# Altium project ee_453_yourname.PrjPcb (part 1 of 2)
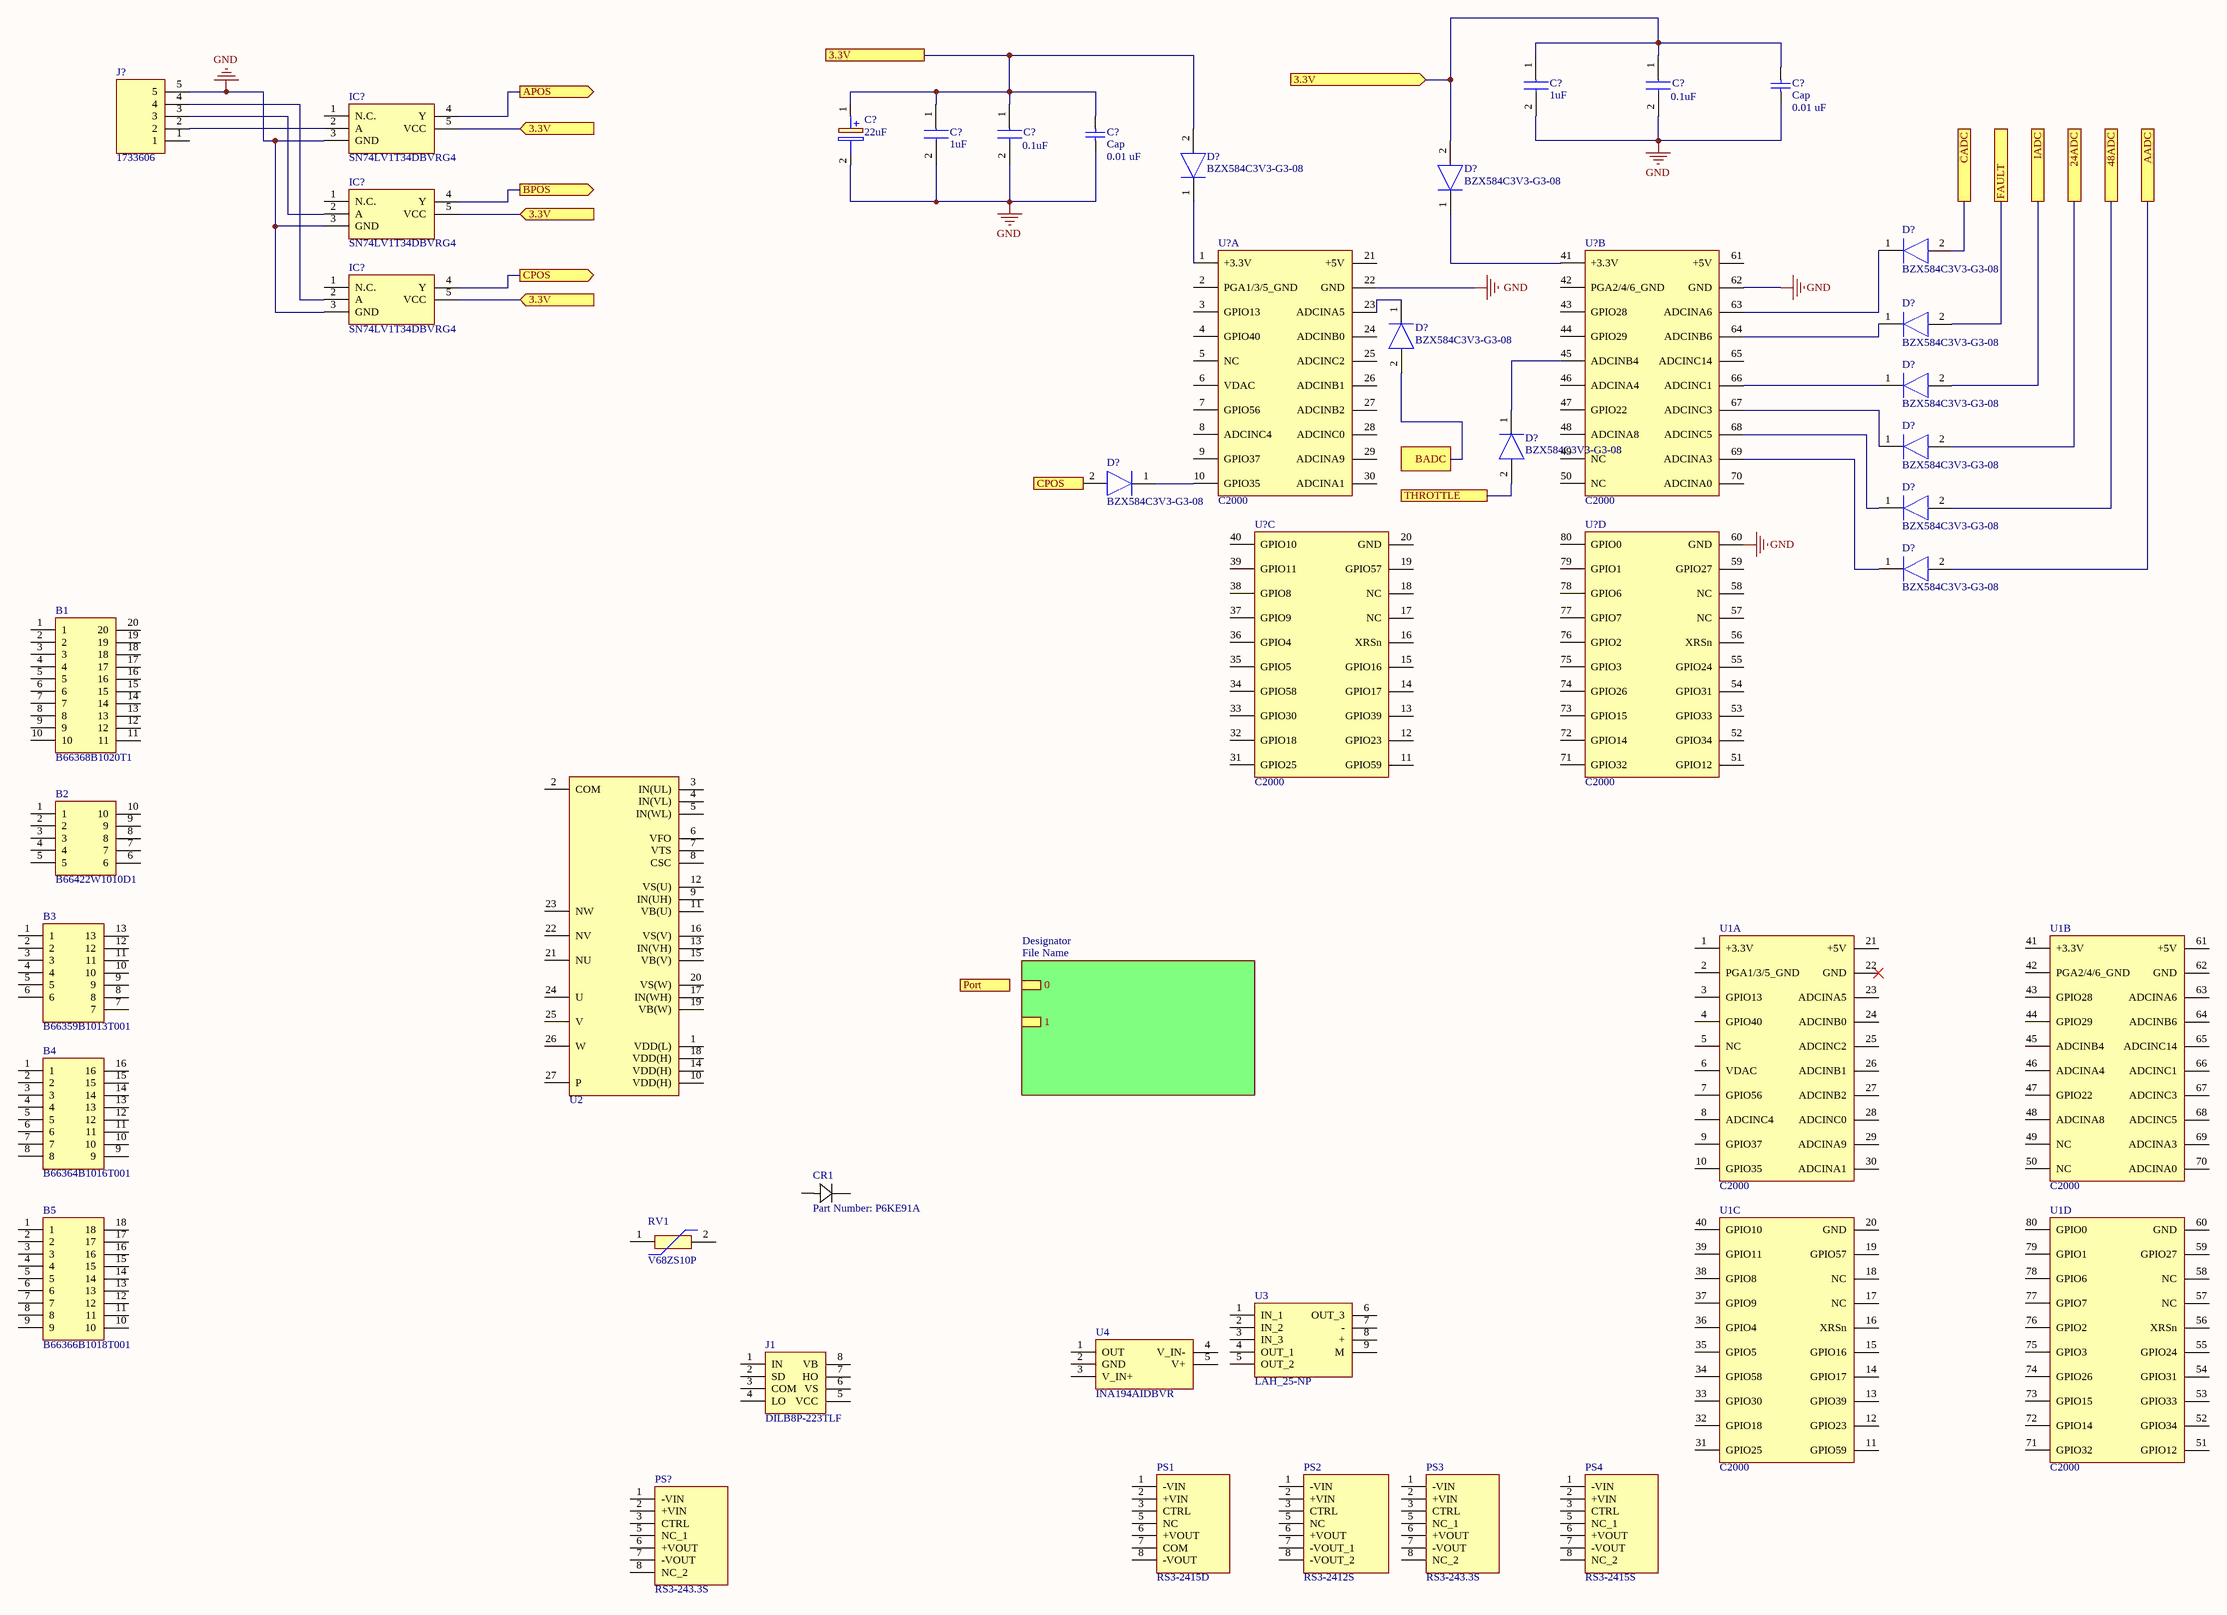
[diagram p0: ee453_pcb_yourname.SchDoc]
7 sheets, 137 parts. Net scope: hierarchical (ports join the sheet entries above them; power ports are global).
Board file: ee453_pcb_yourname.PcbDoc
Sheets:
  ee453_pcb_yourname.SchDoc
  Overall.SchDoc
    DSP = TI_DSP_OLD.SchDoc
    PowerSupply = PowerSupply.SchDoc
    BoostStage = BoostStage.SchDoc
    DrivePowerModule = DrivePowerModule.SchDoc
    Sensors = Sensors.SchDoc

## Sheet ee453_pcb_yourname.SchDoc: EE 453 Capstone
size C; ApprovedBy: Your Name; CheckedBy: Your Name; Author: Your Name; CompanyName: Dept. of Elec. and Comp. Engg.; DrawnBy: Your Name; Engineer: Your Nmae; Organization: UW-Seattle; Address1: 185 Stevens Way; Address2: Paul Allen Center; Address3: Seattle, WA; Address4: US-98195; DocumentNumber: 1; Revision: 1.0; SheetNumber: 1; SheetTotal: 1

### Parts
(Parts that share a designator on the sheet are numbered #1, #2 ... from top to bottom, then left to right.)
B1  B66368B1020T1  [B66368B1020T1]
B2  B66422W1010D1  [B66422W1010D1]
B3  B66359B1013T001  [B66359B1013T001]
B4  B66364B1016T001  [B66364B1016T001]
B5  B66366B1018T001  [B66366B1018T001]
C?#1  1uF  [C330C105K5R5TA7303]
C?#2  0.1uF  [K104K10X7RF5UH5]
C?#3  Cap  value 0.01 uF  [RAD-0.3]
C?#4  22uF  [CAPPRD500W65D1000H2200]
C?#5  1uF  [C330C105K5R5TA7303]
C?#6  0.1uF  [K104K10X7RF5UH5]
C?#7  Cap  value 0.01 uF  [RAD-0.3]
CR1  Part Number: P6KE91A  [P6KESeries]
D?#1  BZX584C3V3-G3-08  [SODFL1608X75N]
D?#2  BZX584C3V3-G3-08  [SODFL1608X75N]
D?#3  BZX584C3V3-G3-08  [SODFL1608X75N]
D?#4  BZX584C3V3-G3-08  [SODFL1608X75N]
D?#5  BZX584C3V3-G3-08  [SODFL1608X75N]
D?#6  BZX584C3V3-G3-08  [SODFL1608X75N]
D?#7  BZX584C3V3-G3-08  [SODFL1608X75N]
D?#8  BZX584C3V3-G3-08  [SODFL1608X75N]
D?#9  BZX584C3V3-G3-08  [SODFL1608X75N]
D?#10  BZX584C3V3-G3-08  [SODFL1608X75N]
D?#11  BZX584C3V3-G3-08  [SODFL1608X75N]
IC?#1  SN74LV1T34DBVRG4  [SOT95P280X145-5N]
IC?#2  SN74LV1T34DBVRG4  [SOT95P280X145-5N]
IC?#3  SN74LV1T34DBVRG4  [SOT95P280X145-5N]
J1  DILB8P-223TLF  [DIPS762W60P254L1016H525Q8N]
J?  1733606  [1733606]
PS1#1  RS3-2415D  [RS32405DH3]
PS2#1  RS3-2412S  [RS32415S]
PS3#1  RS3-243.3S  [RS32433S]
PS4  RS3-2415S  [RS32415S]
PS?  RS3-243.3S  [RS32433S]
RV1  V68ZS10P  [V68ZS10P]
U1  C2000  [C2000]  (parts A,B,C,D of 4)
U2  FNB34060T  [FNB34060T]  (value not drawn)
U3  LAH_25-NP  [LAH-25-NP]
U4  INA194AIDBVR  [SOT95P280X145-5N]
U?#1  C2000  [C2000]  (part B of 4)
U?#2  C2000  [C2000]  (part A of 4)
U?#3  C2000  [C2000]  (part C of 4)
U?#4  C2000  [C2000]  (part D of 4)

### Sub-sheets
Designator = File Name (file not in this document): 0, 1

### Ports
3.3V, 3.3V (in), 24ADC, 48ADC, AADC, APOS (out), BADC, BPOS (out), CADC, CPOS, CPOS (out), FAULT, IADC, Port, THROTTLE

### Nets
 GND: C?#1.2 C?#2.2 C?#3.1 C?#4.2(-) C?#5.2 C?#6.2 C?#7.1 IC?#1.3(GND) IC?#2.3(GND) IC?#3.3(GND) J?.5 U?#1.62(GND) U?#2.22(GND) U?#4.60(GND)  [also labelled GND]
NetC?#1_1: C?#1.1 C?#2.1 C?#3.2 C?#4.1(+) C?#5.1 C?#6.1 C?#7.2 D?#1.2(A) D?#2.2(A) IC?#1.5(VCC) IC?#2.5(VCC) IC?#3.5(VCC) ; port 3.3V
NetD?#1_1: D?#1.1(K) U?#2.1(+3.3V)
NetD?#2_1: D?#2.1(K) U?#1.41(+3.3V)
NetD?#3_1: D?#3.1(K) U?#1.63(ADCINA6)
NetD?#3_2: D?#3.2(A) ; port CADC
NetD?#4_1: D?#4.1(K) U?#2.23(ADCINA5)
NetD?#4_2: D?#4.2(A) ; port BADC
NetD?#5_1: D?#5.1(K) U?#1.64(ADCINB6)
NetD?#5_2: D?#5.2(A) ; port FAULT
NetD?#6_1: D?#6.1(K) U?#1.66(ADCINC1)
NetD?#6_2: D?#6.2(A) ; port IADC
NetD?#7_1: D?#7.1(K) U?#1.45(ADCINB4)
NetD?#7_2: D?#7.2(A) ; port THROTTLE
NetD?#8_1: D?#8.1(K) U?#1.67(ADCINC3)
NetD?#8_2: D?#8.2(A) ; port 24ADC
NetD?#9_1: D?#9.1(K) U?#2.10(GPIO35)
NetD?#9_2: D?#9.2(A) IC?#3.4(Y) ; port CPOS
NetD?#10_1: D?#10.1(K) U?#1.68(ADCINC5)
NetD?#10_2: D?#10.2(A) ; port 48ADC
NetD?#11_1: D?#11.1(K) U?#1.69(ADCINA3)
NetD?#11_2: D?#11.2(A) ; port AADC
NetIC?#1_2: IC?#1.2(A) J?.2
NetIC?#1_4: IC?#1.4(Y) ; port APOS
NetIC?#2_2: IC?#2.2(A) J?.3
NetIC?#2_4: IC?#2.4(Y) ; port BPOS
NetIC?#3_2: IC?#3.2(A) J?.4

Not connected (* = marked no-connect by the designer): B1 1 2 3 4 5 6 7 8 9 10 11 12 13 14 15 16 17 18 19 20; B2 1 2 3 4 5 6 7 8 9 10; B3 1 2 3 4 5 6 7 8 9 10 11 12 13; B4 1 2 3 4 5 6 7 8 9 10 11 12 13 14 15 16; B5 1 2 3 4 5 6 7 8 9 10 11 12 13 14 15 16 17 18; CR1 1 2; IC?#1 1(N.C.); IC?#2 1(N.C.); IC?#3 1(N.C.); J1 1(IN) 2(SD) 3(COM) 4(LO) 5(VCC) 6(VS) 7(HO) 8(VB); J? 1; PS1#1 1(-VIN) 2(+VIN) 3(CTRL) 5(NC) 6(+VOUT) 7(COM) 8(-VOUT); PS2#1 1(-VIN) 2(+VIN) 3(CTRL) 5(NC) 6(+VOUT) 7(-VOUT_1) 8(-VOUT_2); PS3#1 1(-VIN) 2(+VIN) 3(CTRL) 5(NC_1) 6(+VOUT) 7(-VOUT) 8(NC_2); PS4 1(-VIN) 2(+VIN) 3(CTRL) 5(NC_1) 6(+VOUT) 7(-VOUT) 8(NC_2); PS? 1(-VIN) 2(+VIN) 3(CTRL) 5(NC_1) 6(+VOUT) 7(-VOUT) 8(NC_2); RV1 1 2; U1 1(+3.3V) 2(PGA1/3/5_GND) 3(GPIO13) 4(GPIO40) 5(NC) 6(VDAC) 7(GPIO56) 8(ADCINC4) 9(GPIO37) 10(GPIO35) 11(GPIO59) 12(GPIO23) 13(GPIO39) 14(GPIO17) 15(GPIO16) 16(XRSn) 17(NC) 18(NC) 19(GPIO57) 20(GND) 21(+5V) 22(GND)* 23(ADCINA5) 24(ADCINB0) 25(ADCINC2) 26(ADCINB1) 27(ADCINB2) 28(ADCINC0) 29(ADCINA9) 30(ADCINA1) 31(GPIO25) 32(GPIO18) 33(GPIO30) 34(GPIO58) 35(GPIO5) 36(GPIO4) 37(GPIO9) 38(GPIO8) 39(GPIO11) 40(GPIO10) 41(+3.3V) 42(PGA2/4/6_GND) 43(GPIO28) 44(GPIO29) 45(ADCINB4) 46(ADCINA4) 47(GPIO22) 48(ADCINA8) 49(NC) 50(NC) 51(GPIO12) 52(GPIO34) 53(GPIO33) 54(GPIO31) 55(GPIO24) 56(XRSn) 57(NC) 58(NC) 59(GPIO27) 60(GND) 61(+5V) 62(GND) 63(ADCINA6) 64(ADCINB6) 65(ADCINC14) 66(ADCINC1) 67(ADCINC3) 68(ADCINC5) 69(ADCINA3) 70(ADCINA0) 71(GPIO32) 72(GPIO14) 73(GPIO15) 74(GPIO26) 75(GPIO3) 76(GPIO2) 77(GPIO7) 78(GPIO6) 79(GPIO1) 80(GPIO0); U2 1(VDD(L)) 2(COM) 3(IN(UL)) 4(IN(VL)) 5(IN(WL)) 6(VFO) 7(VTS) 8(CSC) 9(IN(UH)) 10(VDD(H)) 11(VB(U)) 12(VS(U)) 13(IN(VH)) 14(VDD(H)) 15(VB(V)) 16(VS(V)) 17(IN(WH)) 18(VDD(H)) 19(VB(W)) 20(VS(W)) 21(NU) 22(NV) 23(NW) 24(U) 25(V) 26(W) 27(P); U3 1(IN_1) 2(IN_2) 3(IN_3) 4(OUT_1) 5(OUT_2) 6(OUT_3) 7(-) 8(+) 9(M); U4 1(OUT) 2(GND) 3(V_IN+) 4(V_IN-) 5(V+); U?#1 42(PGA2/4/6_GND) 43(GPIO28) 44(GPIO29) 46(ADCINA4) 47(GPIO22) 48(ADCINA8) 49(NC) 50(NC) 61(+5V) 65(ADCINC14) 70(ADCINA0); U?#2 2(PGA1/3/5_GND) 3(GPIO13) 4(GPIO40) 5(NC) 6(VDAC) 7(GPIO56) 8(ADCINC4) 9(GPIO37) 21(+5V) 24(ADCINB0) 25(ADCINC2) 26(ADCINB1) 27(ADCINB2) 28(ADCINC0) 29(ADCINA9) 30(ADCINA1); U?#3 11(GPIO59) 12(GPIO23) 13(GPIO39) 14(GPIO17) 15(GPIO16) 16(XRSn) 17(NC) 18(NC) 19(GPIO57) 20(GND) 31(GPIO25) 32(GPIO18) 33(GPIO30) 34(GPIO58) 35(GPIO5) 36(GPIO4) 37(GPIO9) 38(GPIO8) 39(GPIO11) 40(GPIO10); U?#4 51(GPIO12) 52(GPIO34) 53(GPIO33) 54(GPIO31) 55(GPIO24) 56(XRSn) 57(NC) 58(NC) 59(GPIO27) 71(GPIO32) 72(GPIO14) 73(GPIO15) 74(GPIO26) 75(GPIO3) 76(GPIO2) 77(GPIO7) 78(GPIO6) 79(GPIO1) 80(GPIO0)

### Notes on the sheet
- Title
- Size:
- Date:
- File:
- C
- Number:
- Time:
- Revision:
- Sheet
- of

### Library data of the parts
B1 = B66368B1020T1: Bobbin; Manufacturer_Name: EPCOS; Datasheet Link: https://componentsearchengine.com/Datasheets/1/B66368B1020T1.pdf; Height: 40.9mm; Mouser2 Part Number: 871-B66368B1020T1; Mouser2 Price/Stock: https://www.mouser.com/Search/Refine.aspx?Keyword=871-B66368B1020T1; Manufacturer_Part_Number: B66368B1020T1
B2 = B66422W1010D1: Bobbin; Manufacturer_Name: EPCOS; Datasheet Link: https://componentsearchengine.com/Datasheets/1/B66422W1010D1.pdf; Height: 12mm; Mouser2 Part Number: 871-B66422W1010D1; Mouser2 Price/Stock: https://www.mouser.com/Search/Refine.aspx?Keyword=871-B66422W1010D1; Manufacturer_Part_Number: B66422W1010D1
B3 = B66359B1013T001: Bobbin; Manufacturer_Name: EPCOS; Datasheet Link: https://componentsearchengine.com/Datasheets/1/B66359B1013T001.pdf; Height: 25mm; Mouser2 Part Number: 871-B66359B1013T001; Mouser2 Price/Stock: https://www.mouser.com/Search/Refine.aspx?Keyword=871-B66359B1013T001; Manufacturer_Part_Number: B66359B1013T001
B4 = B66364B1016T001: Bobbin; Manufacturer_Name: EPCOS; Datasheet Link: https://componentsearchengine.com/Datasheets/1/B66364B1016T001.pdf; Height: 35.5mm; Mouser2 Part Number: 871-B66364B1016T001; Mouser2 Price/Stock: https://www.mouser.com/Search/Refine.aspx?Keyword=871-B66364B1016T001; Manufacturer_Part_Number: B66364B1016T001
B5 = B66366B1018T001: Bobbin; Manufacturer_Name: EPCOS; Datasheet Link: http://uk.rs-online.com/web/p/products/1620179; Height: 38.4mm; Manufacturer_Part_Number: B66366B1018T001; RS Part Number: 1620179; RS Price/Stock: http://uk.rs-online.com/web/p/products/1620179
C?#1 C?#5 = C330C105K5R5TA7303: Capacitor; Manufacturer_Name: Kemet; Datasheet Link: https://content.kemet.com/datasheets/KEM_C1050_GOLDMAX_X7R.pdf; Height: 10.66mm; Manufacturer_Part_Number: C330C105K5R5TA7303; Mouser Part Number: 80-C330C105K5R-TR; Mouser Price/Stock: https://www.mouser.com/Search/Refine.aspx?Keyword=80-C330C105K5R-TR; Arrow Part Number: C330C105K5R5TA7303; Arrow Price/Stock: https://www.arrow.com/en/products/c330c105k5r5ta7303/kemet-corporation
C?#2 C?#6 = K104K10X7RF5UH5: Capacitor; Manufacturer_Name: Vishay; Datasheet Link: https://www.vishay.com/docs/45171/kseries.pdf; Height: 6.2mm; Manufacturer_Part_Number: K104K10X7RF5UH5; Mouser Part Number: 594-K104K10X7RF5UH5; Mouser Price/Stock: https://www.mouser.co.uk/ProductDetail/Vishay-BC-Components/K104K10X7RF5UH5?qs=rLgk8CAOBHbAqIwDswVbzA%3D%3D; Arrow Part Number: K104K10X7RF5UH5; Arrow Price/Stock: https://www.arrow.com/en/products/k104k10x7rf5uh5/vishay
C?#3 C?#7 = Cap: Capacitor; Published: 8-Jun-2000; LatestRevisionDate: 17-Jul-2002; LatestRevisionNote: Re-released for DXP Platform.; PackageReference: RAD-0.3; Publisher: Altium Limited; PackageDescription: Radial Cap, Thru-Hole; 2 Leads; 0.3 in Pin Spacing
C?#4 = EEU-ED2E220: Capacitor Polarised; Manufacturer_Name: Panasonic; Datasheet Link: https://industrial.panasonic.com/cdbs/www-data/pdf/RDF0000/ABA0000C1258.pdf; Height: 22mm; Manufacturer_Part_Number: EEU-ED2E220
CR1 = P6KE91A: No Description Available; Vendor: Littelfuse Inc; Built_By: EMA_UL_Team; Type: DEV; Manufacturer_Part_Number: P6KE91A; Copyright: Copyright (C) 2018 Accelerated Designs. All rights reserved; RefDes: RefDes; Value: Value
D?#1-D?#11 = BZX584C3V3-G3-08: Diode; Manufacturer_Name: Vishay; Datasheet Link: https://componentsearchengine.com/Datasheets/1/BZX584C3V3-G3-08.pdf; Height: 0.75mm; Manufacturer_Part_Number: BZX584C3V3-G3-08; Mouser Part Number: 78-BZX584C3V3-G3-08; Mouser Price/Stock: https://www.mouser.co.uk/ProductDetail/Vishay-Semiconductors/BZX584C3V3-G3-08?qs=OTrKUuiFdkYVBI02zFffJQ%3D%3D
IC?#1-IC?#3 = SN74LV1T34DBVRG4: Integrated Circuit; Manufacturer_Name: Texas Instruments; Datasheet Link: http://www.ti.com/lit/gpn/sn74lv1t34; Height: 1.45mm; Manufacturer_Part_Number: SN74LV1T34DBVRG4; Mouser Part Number: 595-SN74LV1T34DBVRG4; Mouser Price/Stock: https://www.mouser.co.uk/ProductDetail/Texas-Instruments/SN74LV1T34DBVRG4?qs=vdi0iO8H4N10R%252Bt%252BjmxZrg%3D%3D; Arrow Part Number: SN74LV1T34DBVRG4; Arrow Price/Stock: https://www.arrow.com/en/products/sn74lv1t34dbvrg4/texas-instruments
J1 = DILB8P-223TLF: Connector; Manufacturer_Name: Amphenol; Datasheet Link: https://componentsearchengine.com/Datasheets/1/DILB8P-223TLF.pdf; Height: 5.25mm; Mouser2 Part Number: 649-DILB8P223TLF; Mouser2 Price/Stock: https://www.mouser.com/Search/Refine.aspx?Keyword=649-DILB8P223TLF; Manufacturer_Part_Number: DILB8P-223TLF
J? = 1733606: Connector; Manufacturer_Name: Phoenix Contact; Datasheet Link: https://www.phoenixcontact.com/online/portal/us?uri=pxc-oc-itemdetail:pid=1733606&library=usen&tab=1; Height: 15.45mm; Manufacturer_Part_Number: 1733606; Mouser Part Number: 651-1733606; Mouser Price/Stock: https://www.mouser.co.uk/ProductDetail/Phoenix-Contact/1733606/?qs=coeDwHeOZKnxpzvXWWKBZQ%3D%3D; Arrow Part Number: 1733606; Arrow Price/Stock: https://www.arrow.com/en/products/1733606/phoenix-contact
PS1#1 = RS3-2415D: Power Supply; Manufacturer_Name: RECOM Power; Allied_Number: 70052275; Datasheet Link: https://www.recom-power.com/pdf/Econoline/RS3-S_D_Z.pdf; Height: 11.35mm; Manufacturer_Part_Number: RS3-2415D; Mouser Part Number: 919-RS3-2415D; Mouser Price/Stock: https://www.mouser.com/Search/Refine.aspx?Keyword=919-RS3-2415D; RS Part Number: 1669089; RS Price/Stock: https://uk.rs-online.com/web/p/products/1669089; Allied Price/Stock: https://www.alliedelec.com/recom-power-inc-rs3-2415d/70052275/
PS2#1 = RS3-2412S: 24/12V Power Supply; Manufacturer_Name: RECOM Power; Datasheet Link: https://www.recom-power.com/pdf/Econoline/RS3-S_D_Z.pdf; Manufacturer_Part_Number: RS3-2412S; Mouser Part Number: 919-RS3-2412S; Mouser Price/Stock: https://www.mouser.com/Search/Refine.aspx?Keyword=919-RS3-2412S; RS Part Number: 1669097; RS Price/Stock: https://uk.rs-online.com/web/p/products/1669097
PS3#1 = RS3-243.3S: 24/3.3V Power Supply; Manufacturer_Name: RECOM Power; Datasheet Link: https://www.arrow.com/en/products/rs3-243.3s/recom-power; Height: 11.35mm; Manufacturer_Part_Number: RS3-243.3S; Mouser Part Number: 919-RS3-243.3S; Mouser Price/Stock: https://www.mouser.com/Search/Refine.aspx?Keyword=919-RS3-243.3S; RS Part Number: 0163748P; RS Price/Stock: http://uk.rs-online.com/web/p/products/0163748P
PS4 = RS3-2415S: 24/15V Power Supply; Manufacturer_Name: RECOM Power; Datasheet Link: https://www.recom-power.com/pdf/Econoline/RS3-S_D_Z.pdf; Height: 11.35mm; Manufacturer_Part_Number: RS3-2415S; Mouser Part Number: 919-RS3-2415S; Mouser Price/Stock: https://www.mouser.com/Search/Refine.aspx?Keyword=919-RS3-2415S
PS? = RS3-243.3S: Power Supply; Manufacturer_Name: RECOM Power; Datasheet Link: https://www.arrow.com/en/products/rs3-243.3s/recom-power; Height: 11.35mm; Manufacturer_Part_Number: RS3-243.3S; Mouser Part Number: 919-RS3-243.3S; Mouser Price/Stock: https://www.mouser.com/Search/Refine.aspx?Keyword=919-RS3-243.3S; Arrow Part Number: RS3-243.3S; Arrow Price/Stock: https://www.arrow.com/en/products/rs3-243.3s/recom-power
RV1 = V68ZS10P: Varistor; Manufacturer_Name: LITTELFUSE; Datasheet Link: http://www.littelfuse.com/~/media/electronics/datasheets/varistors/littelfuse_varistor_za_datasheet.pdf.pdf; Height: 20mm; Manufacturer_Part_Number: V68ZS10P
U1 U?#1-U?#4 = C2000: F280049C; Parameter 1: test 2
U3 = LAH_25-NP: Integrated Circuit; Manufacturer_Name: LEM; Manufacturer_Part_Number: LAH 25-NP; Datasheet Link: http://www.lem.com/docs/products/lah_25-np.pdf
U4 = INA194AIDBVR: Integrated Circuit; Manufacturer_Name: Texas Instruments; Datasheet Link: http://www.ti.com/lit/gpn/ina194; Height: 1.45mm; Manufacturer_Part_Number: INA194AIDBVR

## Sheet Overall.SchDoc
size A
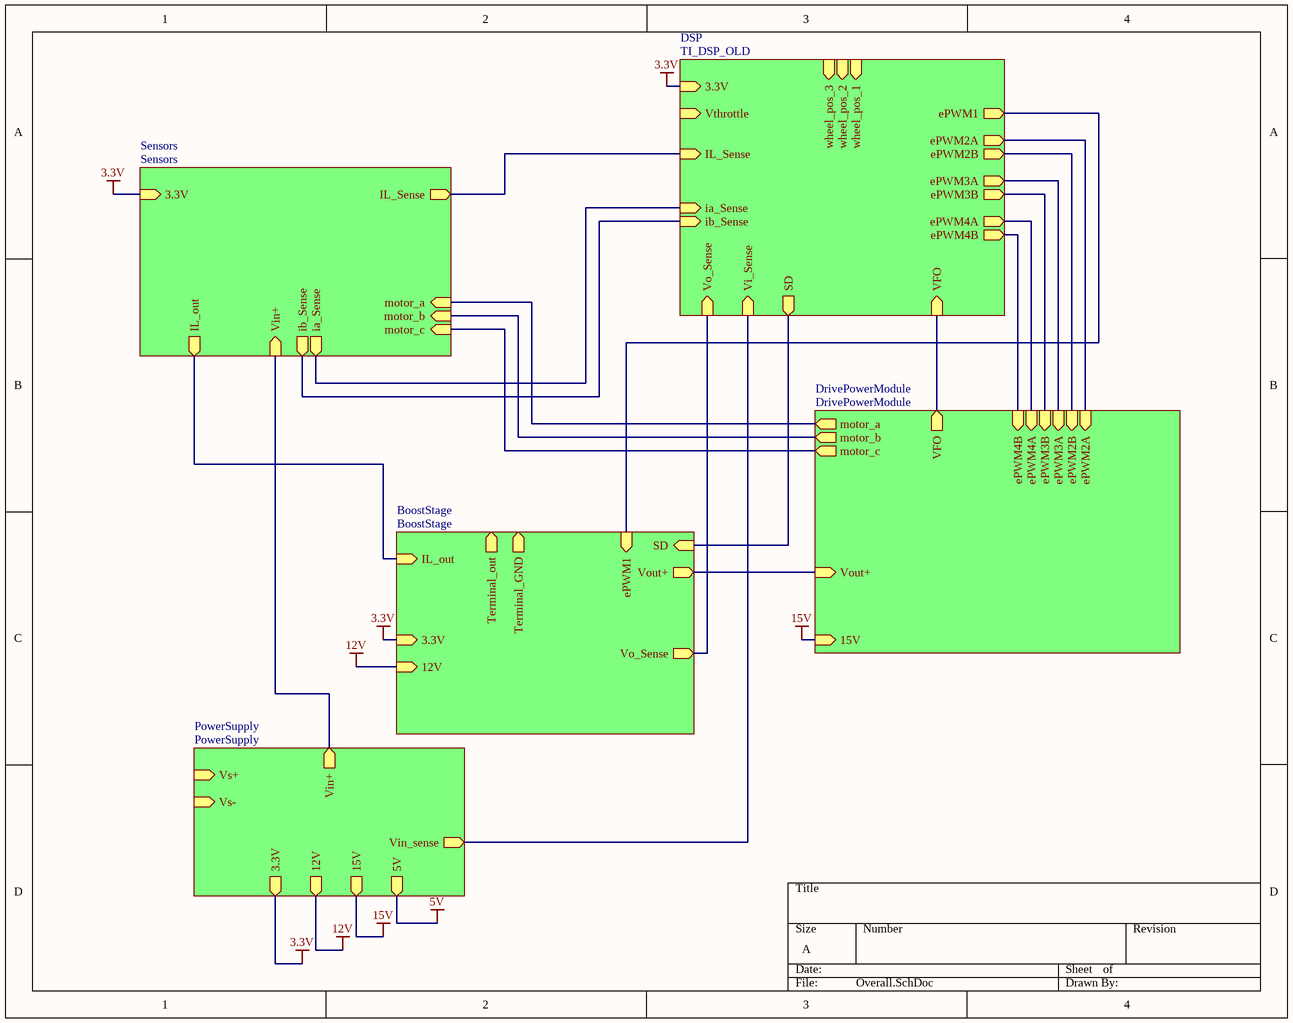
[diagram p1: Overall.SchDoc]

### Sub-sheets
BoostStage = BoostStage: IL_out (in), 12V (in), ePWM1 (in), SD (in), Terminal_out (out), Terminal_GND (out), 3.3V (in), Vout+ (out), Vo_Sense (out)
DrivePowerModule = DrivePowerModule: ePWM2A (in), ePWM2B (in), ePWM3A (in), ePWM3B (in), ePWM4A (in), ePWM4B (in), motor_b (out), motor_a (out), motor_c (out), 15V (in), VFO (out), Vout+ (in)
DSP = TI_DSP_OLD: 3.3V (in), Vi_Sense (in), Vo_Sense (in), IL_Sense (in), VFO (in), Vthrottle (in), ia_Sense (in), ib_Sense (in), SD (out), wheel_pos_1 (in), wheel_pos_2 (in), wheel_pos_3 (in), ePWM1 (out), ePWM2B (out), ePWM2A (out), ePWM3A (out), ePWM4A (out), ePWM3B (out), ePWM4B (out)
PowerSupply = PowerSupply: Vs+ (in), Vs- (in), Vin+ (out), 3.3V (out), 12V (out), 15V (out), Vin_sense (out), 5V (out)
Sensors = Sensors: 3.3V (in), ia_Sense (out), ib_Sense (out), IL_Sense (out), motor_a (in), motor_b (in), Vin+ (in), IL_out (out), motor_c (in)

### Nets
3.3V: sheet DSP/3.3V, sheet PowerSupply/3.3V, sheet BoostStage/3.3V, sheet Sensors/3.3V
12V: sheet PowerSupply/12V, sheet BoostStage/12V
15V: sheet PowerSupply/15V, sheet DrivePowerModule/15V
TP8: sheet DSP/ePWM1, sheet BoostStage/ePWM1
Net3Terminal:2_3: sheet DrivePowerModule/motor_c, sheet Sensors/motor_c
Net48V_test_1: sheet BoostStage/Vout+, sheet DrivePowerModule/Vout+
NetBobbin_1: sheet BoostStage/IL_out, sheet Sensors/IL_out
NetC1:7_2: sheet DSP/VFO, sheet DrivePowerModule/VFO
NetCdc24V_1: sheet PowerSupply/Vin+, sheet Sensors/Vin+
Nethall_IA_1: sheet DrivePowerModule/motor_a, sheet Sensors/motor_a
Nethall_IA_7: sheet DSP/ia_Sense, sheet Sensors/ia_Sense
Nethall_IB_1: sheet DrivePowerModule/motor_b, sheet Sensors/motor_b
Nethall_IB_7: sheet DSP/ib_Sense, sheet Sensors/ib_Sense
Nethall_IL_7: sheet DSP/IL_Sense, sheet Sensors/IL_Sense
NetIC1_Socket_2: sheet DSP/SD, sheet BoostStage/SD
NetOP-AMP2_1: sheet DSP/Vo_Sense, sheet BoostStage/Vo_Sense
NetR1:1_2: sheet DSP/ePWM2A, sheet DrivePowerModule/ePWM2A
NetR1:2_2: sheet DSP/ePWM3A, sheet DrivePowerModule/ePWM3A
NetR1:3_2: sheet DSP/ePWM4A, sheet DrivePowerModule/ePWM4A
NetR1:4_2: sheet DSP/ePWM2B, sheet DrivePowerModule/ePWM2B
NetR1:5_2: sheet DSP/ePWM3B, sheet DrivePowerModule/ePWM3B
NetR1:6_2: sheet DSP/ePWM4B, sheet DrivePowerModule/ePWM4B
NetUDSP_23: sheet DSP/Vi_Sense, sheet PowerSupply/Vin_sense

## Sheet TI_DSP_OLD.SchDoc
size A
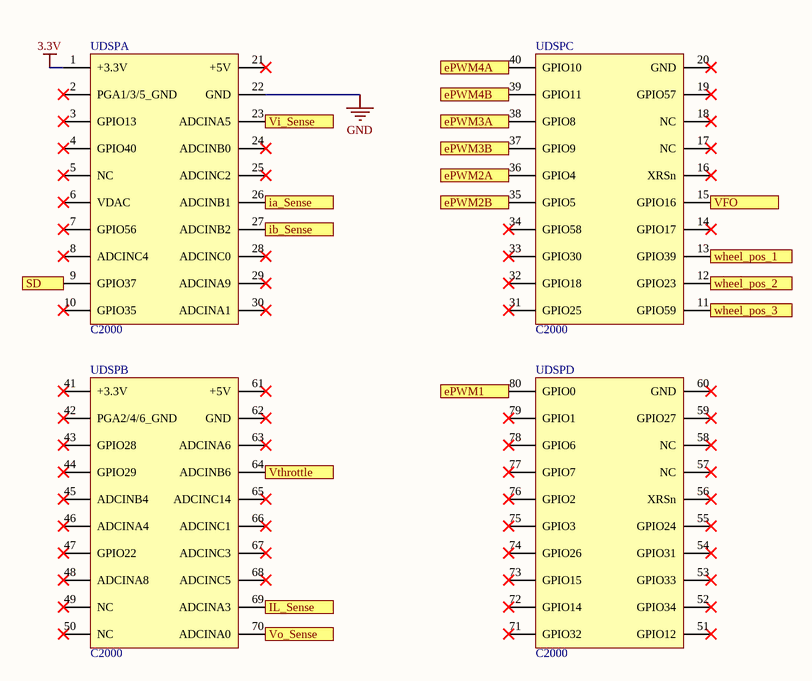
[diagram p2: TI_DSP_OLD.SchDoc]

### Parts
UDSP  C2000  [C2000]  (parts A,B,C,D of 4)

### Ports
ePWM1 (out), ePWM2A (out), ePWM2B (out), ePWM3A (out), ePWM3B (out), ePWM4A (out), ePWM4B (out), ia_Sense (in), ib_Sense (in), IL_Sense (in), SD (out), VFO (in), Vi_Sense (in), Vo_Sense (in), Vthrottle (in), wheel_pos_1 (in), wheel_pos_2 (in), wheel_pos_3 (in)

### Nets
3.3V: UDSP.1(+3.3V)
GND: UDSP.22(GND)  [project net  GND]
TP8: UDSP.80(GPIO0) ; port ePWM1
NetC1:7_2: UDSP.15(GPIO16) ; port VFO
Nethall_IA_7: UDSP.26(ADCINB1) ; port ia_Sense
Nethall_IB_7: UDSP.27(ADCINB2) ; port ib_Sense
Nethall_IL_7: UDSP.69(ADCINA3) ; port IL_Sense
NetIC1_Socket_2: UDSP.9(GPIO37) ; port SD
NetOP-AMP2_1: UDSP.70(ADCINA0) ; port Vo_Sense
NetR1:1_2: UDSP.36(GPIO4) ; port ePWM2A
NetR1:2_2: UDSP.38(GPIO8) ; port ePWM3A
NetR1:3_2: UDSP.40(GPIO10) ; port ePWM4A
NetR1:4_2: UDSP.35(GPIO5) ; port ePWM2B
NetR1:5_2: UDSP.37(GPIO9) ; port ePWM3B
NetR1:6_2: UDSP.39(GPIO11) ; port ePWM4B
NetUDSP_11: UDSP.11(GPIO59) ; port wheel_pos_3
NetUDSP_12: UDSP.12(GPIO23) ; port wheel_pos_2
NetUDSP_13: UDSP.13(GPIO39) ; port wheel_pos_1
NetUDSP_23: UDSP.23(ADCINA5) ; port Vi_Sense
NetUDSP_64: UDSP.64(ADCINB6) ; port Vthrottle

Not connected (* = marked no-connect by the designer): UDSP 2(PGA1/3/5_GND)* 3(GPIO13)* 4(GPIO40)* 5(NC)* 6(VDAC)* 7(GPIO56)* 8(ADCINC4)* 10(GPIO35)* 14(GPIO17)* 16(XRSn)* 17(NC)* 18(NC)* 19(GPIO57)* 20(GND)* 21(+5V)* 24(ADCINB0)* 25(ADCINC2)* 28(ADCINC0)* 29(ADCINA9)* 30(ADCINA1)* 31(GPIO25)* 32(GPIO18)* 33(GPIO30)* 34(GPIO58)* 41(+3.3V)* 42(PGA2/4/6_GND)* 43(GPIO28)* 44(GPIO29)* 45(ADCINB4)* 46(ADCINA4)* 47(GPIO22)* 48(ADCINA8)* 49(NC)* 50(NC)* 51(GPIO12)* 52(GPIO34)* 53(GPIO33)* 54(GPIO31)* 55(GPIO24)* 56(XRSn)* 57(NC)* 58(NC)* 59(GPIO27)* 60(GND)* 61(+5V)* 62(GND)* 63(ADCINA6)* 65(ADCINC14)* 66(ADCINC1)* 67(ADCINC3)* 68(ADCINC5)* 71(GPIO32)* 72(GPIO14)* 73(GPIO15)* 74(GPIO26)* 75(GPIO3)* 76(GPIO2)* 77(GPIO7)* 78(GPIO6)* 79(GPIO1)*

### Library data of the parts
UDSP = C2000: F280049C; Parameter 1: test 2

## Sheet PowerSupply.SchDoc
size A
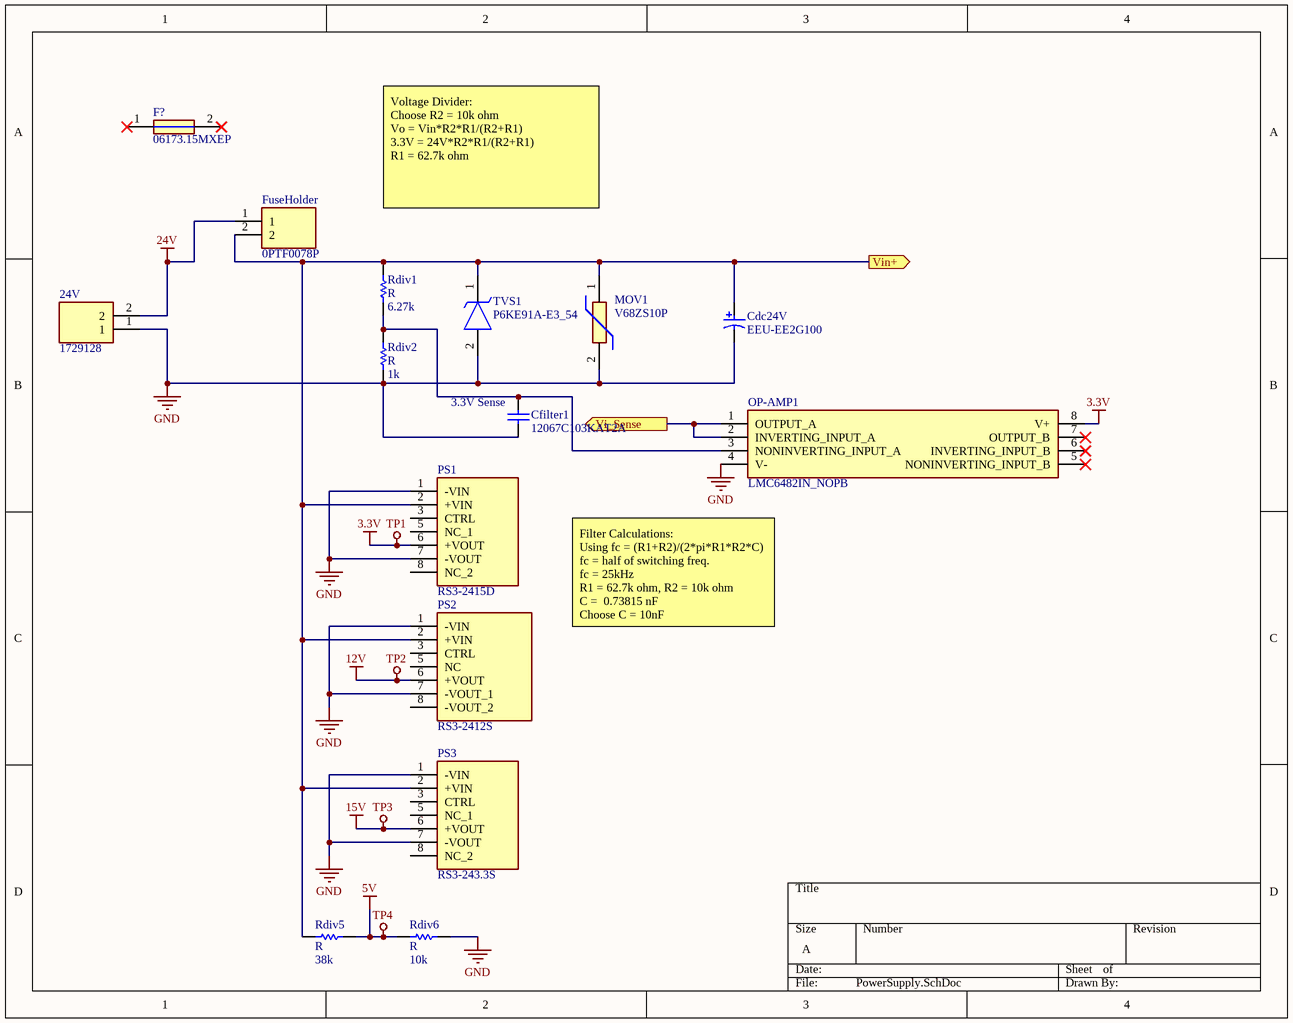
[diagram p3: PowerSupply.SchDoc]

### Parts
(Parts that share a designator on the sheet are numbered #1, #2 ... from top to bottom, then left to right.)
24V  1729128  [HDRV2W110P0X508_1X2_1016X810X1000P]
Cdc24V  EEU-EE2G100  [PNSC-EEU-EE2G100-2_V]
Cfilter1  12067C103KAT2A  [CAPC1206(3216)170_N]
F?  06173.15MXEP  [0617315MXEP]
FuseHolder  0PTF0078P  [0PTF0078P]
MOV1  V68ZS10P  [V68ZS10P]
OP-AMP1  LMC6482IN_NOPB  [DIP794W53P254L959H508Q8N]
PS1#2  RS3-2415D  [RS32405DH3]
PS2#2  RS3-2412S  [RS32415S]
PS3#2  RS3-243.3S  [RS32433S]
Rdiv1  R  value 6.27k  [AXIAL-0.3]
Rdiv2  R  value 1k  [AXIAL-0.3]
Rdiv5  R  value 38k  [AXIAL-0.3]
Rdiv6  R  value 10k  [AXIAL-0.3]
TVS1  P6KE91A-E3_54  [DIOAD1910W86L670D310]

### Ports
Vi_Sense (out), Vin+ (out)

### Nets
3.3V: OP-AMP1.8(V+) PS1#2.6(+VOUT)  [also labelled TP1]
5V: Rdiv5.2 Rdiv6.1  [also labelled TP4]
12V: PS2#2.6(+VOUT)  [also labelled TP2]
15V: PS3#2.6(+VOUT)  [also labelled TP3]
24V: 24V.2 FuseHolder.1
GND: 24V.1 Cdc24V.2 Cfilter1.1 MOV1.2 OP-AMP1.4(V-) PS1#2.1(-VIN) PS1#2.7(-VOUT) PS2#2.1(-VIN) PS2#2.7(-VOUT_1) PS3#2.1(-VIN) PS3#2.7(-VOUT) Rdiv2.1 Rdiv6.2 TVS1.2(A)  [project net  GND]
NetCdc24V_1: Cdc24V.1 FuseHolder.2 MOV1.1 PS1#2.2(+VIN) PS2#2.2(+VIN) PS3#2.2(+VIN) Rdiv1.2 Rdiv5.1 TVS1.1(K) ; port Vin+
NetCfilter1_2: Cfilter1.2 OP-AMP1.3(NONINVERTING_INPUT_A) Rdiv1.1 Rdiv2.2
NetOP-AMP1_1: OP-AMP1.1(OUTPUT_A) OP-AMP1.2(INVERTING_INPUT_A) ; port Vi_Sense

Not connected (* = marked no-connect by the designer): F? 1* 2*; OP-AMP1 5(NONINVERTING_INPUT_B)* 6(INVERTING_INPUT_B)* 7(OUTPUT_B)*; PS1#2 3(CTRL) 5(NC_1) 8(NC_2); PS2#2 3(CTRL) 5(NC) 8(-VOUT_2); PS3#2 3(CTRL) 5(NC_1) 8(NC_2)

### Notes on the sheet
- Voltage Divider:
  Choose R2 = 10k ohm
  Vo = Vin*R2*R1/(R2+R1)
  3.3V = 24V*R2*R1/(R2+R1)
  R1 = 62.7k ohm
- (near Cfilter1) 3.3V Sense
- Filter Calculations:
  Using fc = (R1+R2)/(2*pi*R1*R2*C)
  fc = half of switching freq.
  fc = 25kHz
  R1 = 62.7k ohm, R2 = 10k ohm
  C =  0.73815 nF
  Choose C = 10nF

### Library data of the parts
24V = 1729128: Connector; Manufacturer_Name: Phoenix Contact; Datasheet Link: http://docs-emea.rs-online.com/webdocs/1380/0900766b81380189.pdf; Height: 10mm; Manufacturer_Part_Number: 1729128; Mouser Part Number: 651-1729128; Mouser Price/Stock: https://www.mouser.co.uk/ProductDetail/Phoenix-Contact/1729128?qs=GFUSqQMLmmnCBVBY3dts9w%3D%3D; Arrow Part Number: 1729128; Arrow Price/Stock: https://www.arrow.com/en/products/1729128/phoenix-contact
Cdc24V = CMP-0736-00002-1: Aluminum Electrolytic Capacitor, 10 uF +/- 20%, 400 V, -25 to 105 degC, 2-Pin 10 x 10 x 22 mm Through-hole, RoHS, Tape and Reel; Manufacturer: Panasonic; Ripple Current: 430 mA; Rated Voltage: 400 V; Cap.: 10 uF; Capacitance Tolerance: +/- 20%; ComponentLink2URL: http://industrial.panasonic.com/www-data/pdf/ABA0000/ABA0000CE113.pdf; Mounting Technology: Through Hole; PackageVersion: Nov-12; ComponentLink3URL: http://industrial.panasonic.com/www-data/pdf/ABA0000/ABA0000PE245.pdf; ComponentLink2Description: Datasheet; PartNumber: EEU-EE2G100; DatasheetVersion: Nov-12; PackageDescription: 2-Pin Through-hole, Base 10 x 10 mm, Height 22 mm; PackageReference: EEU-EE2G100-2; ComponentLink1URL: http://industrial.panasonic.com/; Temp. Range: -25 to 105 degC; RoHS: TRUE; Packing: Tape and Reel; ComponentLink1Description: Manufacturer URL; ComponentLink3Description: Package Specification
Cfilter1 = CMP-1037-03540-1: CAP 10nF 500V ±10% 1206 (3216 Metric) Thickness 1.7mm SMD; Tolerance: Â±10%; Case-Metric: 3216; Case-EIA: 1206; Rated Voltage: 500 V; Value: 10nF; Max Thickness: 1.7 mm; Technology: SMT
F? = 06173.15MXEP: Fuse; Manufacturer_Name: LITTELFUSE; Datasheet Link: https://componentsearchengine.com/Datasheets/1/06173.15MXEP.pdf; Height: 5.8mm; Manufacturer_Part_Number: 06173.15MXEP; Mouser Part Number: 576-06173.15MXEP; Mouser Price/Stock: https://www.mouser.co.uk/ProductDetail/Littelfuse/0617315MXEP?qs=aGgfWYEhH7lCEoTlvK5w%252Bw%3D%3D; Arrow Part Number: 06173.15MXEP; Arrow Price/Stock: https://www.arrow.com/en/products/06173.15mxep/littelfuse
FuseHolder = 0PTF0078P: Undefined or Miscellaneous; Manufacturer_Name: LITTELFUSE; Datasheet Link: https://media.digikey.com/pdf/Data%20Sheets/Littelfuse%20PDFs/PTF075_77_78.pdf; Height: 11.5mm; Manufacturer_Part_Number: 0PTF0078P; Mouser Part Number: 576-0PTF0078P; Mouser Price/Stock: https://www.mouser.co.uk/ProductDetail/Littelfuse/0PTF0078P?qs=Co4VkB5J4%2Fsczy6gG8s%2FsA%3D%3D; Arrow Part Number: 0PTF0078P; Arrow Price/Stock: https://www.arrow.com/en/products/0ptf0078p/littelfuse
MOV1 = V68ZS10P: Varistor; Manufacturer_Name: LITTELFUSE; Datasheet Link: http://www.littelfuse.com/~/media/electronics/datasheets/varistors/littelfuse_varistor_za_datasheet.pdf.pdf; Height: 20mm; Manufacturer_Part_Number: V68ZS10P; Mouser Part Number: 576-V68ZS10P; Mouser Price/Stock: https://www.mouser.co.uk/ProductDetail/Littelfuse/V68ZS10P?qs=1%2FWRN91BpNvIRlTsONWDiQ%3D%3D
OP-AMP1 = LMC6482IN_NOPB: Integrated Circuit; Manufacturer_Name: Texas Instruments; Manufacturer_Part_Number: LMC6482IN/NOPB; Datasheet Link: http://www.ti.com/lit/gpn/lmc6482; Height: 5.08mm; Mouser Part Number: 926-LMC6482IN/NOPB; Mouser Price/Stock: https://www.mouser.co.uk/ProductDetail/Texas-Instruments/LMC6482IN-NOPB?qs=QbsRYf82W3EByDDrj8Vijg%3D%3D; Arrow Part Number: LMC6482IN/NOPB; Arrow Price/Stock: https://www.arrow.com/en/products/lmc6482innopb/texas-instruments
PS1#2 = RS3-243.3S: as PS3#1 on sheet ee453_pcb_yourname; Datasheet Link: https://www.arrow.com/en/products/rs3-243.3s/recom-power; Height: 11.35mm; Manufacturer_Part_Number: RS3-243.3S; Mouser Part Number: 919-RS3-243.3S; Mouser Price/Stock: https://www.mouser.com/Search/Refine.aspx?Keyword=919-RS3-243.3S; RS Part Number: 0163748P; RS Price/Stock: http://uk.rs-online.com/web/p/products/0163748P
PS2#2 = RS3-2412S: as PS2#1 on sheet ee453_pcb_yourname; Datasheet Link: https://www.recom-power.com/pdf/Econoline/RS3-S_D_Z.pdf; Manufacturer_Part_Number: RS3-2412S; Mouser Part Number: 919-RS3-2412S; Mouser Price/Stock: https://www.mouser.com/Search/Refine.aspx?Keyword=919-RS3-2412S; RS Part Number: 1669097; RS Price/Stock: https://uk.rs-online.com/web/p/products/1669097
PS3#2 = RS3-2415S: as PS4 on sheet ee453_pcb_yourname; Datasheet Link: https://www.recom-power.com/pdf/Econoline/RS3-S_D_Z.pdf; Height: 11.35mm; Manufacturer_Part_Number: RS3-2415S; Mouser Part Number: 919-RS3-2415S; Mouser Price/Stock: https://www.mouser.com/Search/Refine.aspx?Keyword=919-RS3-2415S
Rdiv1 = Res1: 1/4W 62.727K ohm Resistor; Published: 8-Jun-2000; LatestRevisionDate: 17-Jul-2002; LatestRevisionNote: Re-released for DXP Platform.; PackageReference: AXIAL-0.3; Publisher: Altium Limited; PackageDescription: Axial Device, Thru-Hole; 2 Leads; 0.3 in Pin Spacing
Rdiv2 Rdiv5 Rdiv6 = Res1: 1/4W 10k ohm Resistor; Published: 8-Jun-2000; LatestRevisionDate: 17-Jul-2002; LatestRevisionNote: Re-released for DXP Platform.; PackageReference: AXIAL-0.3; Publisher: Altium Limited; PackageDescription: Axial Device, Thru-Hole; 2 Leads; 0.3 in Pin Spacing
TVS1 = P6KE91A-E3_54: TVS Diode (Uni-directional); Manufacturer_Name: Vishay; Manufacturer_Part_Number: P6KE91A-E3/54; Datasheet Link: https://www.mouser.com/datasheet/2/427/p6ke-1767850.pdf

## Sheet BoostStage.SchDoc
size A
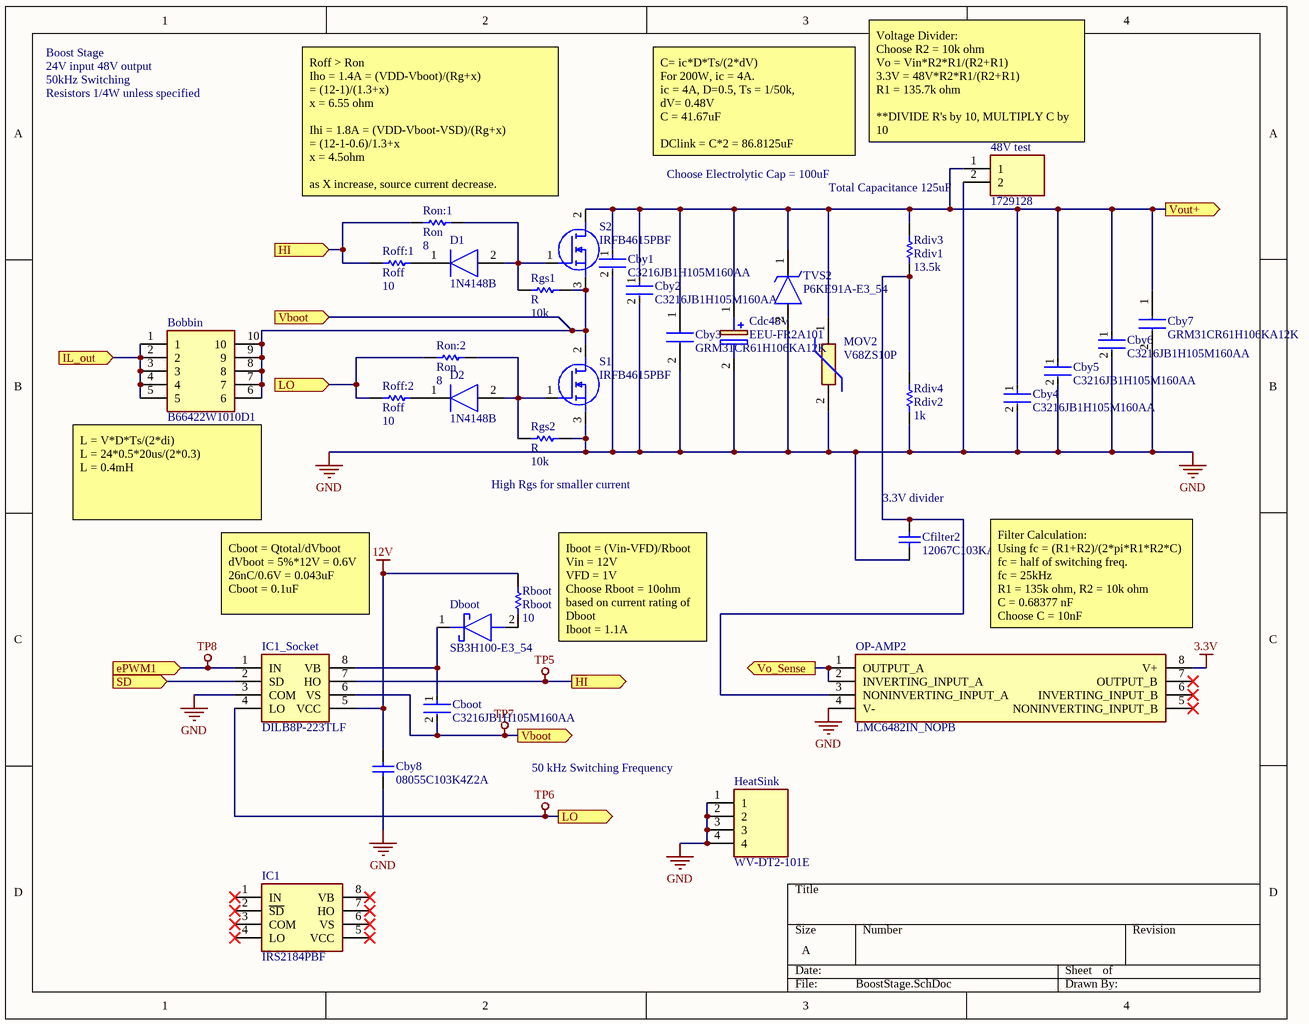
[diagram p4: BoostStage.SchDoc]

### Parts
48V_test  1729128  [HDRV2W110P0X508_1X2_1016X810X1000P]
Bobbin  B66422W1010D1  [B66422W1010D1]
Cboot  C3216JB1H105M160AA  [FP-C3216-160-0_2-IPC_B]
Cby1  C3216JB1H105M160AA  [FP-C3216-160-0_2-IPC_B]
Cby2  C3216JB1H105M160AA  [FP-C3216-160-0_2-IPC_B]
Cby3  GRM31CR61H106KA12K  [CAPC3216X180N]
Cby4  C3216JB1H105M160AA  [FP-C3216-160-0_2-IPC_B]
Cby5  C3216JB1H105M160AA  [FP-C3216-160-0_2-IPC_B]
Cby6  C3216JB1H105M160AA  [FP-C3216-160-0_2-IPC_B]
Cby7  GRM31CR61H106KA12K  [CAPC3216X180N]
Cby8  08055C103K4Z2A  [CAPC2013X94X50NL20T25]
Cdc48V  EEU-FR2A101  [CAPPRD500W65D1000H2200]
Cfilter2  12067C103KAT2A  [CAPC1206(3216)170_N]
D1  1N4148B  [DIOAD990W55L340D162]
D2  1N4148B  [DIOAD990W55L340D162]
Dboot  SB3H100-E3_54  [DIOAD2855W132L835D505]
HeatSink  WV-DT2-101E  [WVDT2101E]
IC1  IRS2184PBF  [DIP762W56P254L988H533Q8N]
IC1_Socket  DILB8P-223TLF  [DIPS762W60P254L1016H525Q8N]
MOV2  V68ZS10P  [V68ZS10P]
OP-AMP2  LMC6482IN_NOPB  [DIP794W53P254L959H508Q8N]
Rboot  Rboot  value 10  [AXIAL-0.3]
Rdiv3  Rdiv1  value 13.5k  [AXIAL-0.3]
Rdiv4  Rdiv2  value 1k  [AXIAL-0.3]
Rgs1  R  value 10k  [AXIAL-0.3]
Rgs2  R  value 10k  [AXIAL-0.3]
Roff:1  Roff  value 10  [AXIAL-0.3]
Roff:2  Roff  value 10  [AXIAL-0.3]
Ron:1  Ron  value 8  [AXIAL-0.3]
Ron:2  Ron  value 8  [AXIAL-0.3]
S1  IRFB4615PBF  [TO254P483X1016X1994-3P]
S2  IRFB4615PBF  [TO254P483X1016X1994-3P]
TVS2  P6KE91A-E3_54  [DIOAD1910W86L670D310]

### Ports
ePWM1 (in), HI (in), HI (out), IL_out (in), LO (in), LO (out), SD (in), Vboot (in), Vboot (out), Vo_Sense (out), Vout+ (out)

### Nets
3.3V: OP-AMP2.8(V+)
12V: Cby8.1 IC1_Socket.5(VCC) Rboot.2
GND: 48V_test.2 Cby1.2 Cby2.2 Cby3.2 Cby4.2 Cby5.2 Cby6.2 Cby7.2 Cby8.2 Cdc48V.2(-) Cfilter2.1 HeatSink.1 HeatSink.2 HeatSink.3 HeatSink.4 IC1_Socket.3(COM) MOV2.2 OP-AMP2.4(V-) Rdiv4.1 Rgs2.2 S1.3(S) TVS2.2(A)  [project net  GND]
TP5: IC1_Socket.7(HO) Roff:1.1 Ron:1.1 ; port HI
TP6: IC1_Socket.4(LO) Roff:2.1 Ron:2.1 ; port LO
TP7: Bobbin.6 Bobbin.7 Bobbin.8 Bobbin.9 Bobbin.10 Cboot.2 IC1_Socket.6(VS) Rgs1.2 S1.2(D) S2.3(S) ; port Vboot
TP8: IC1_Socket.1(IN) ; port ePWM1
Net48V_test_1: 48V_test.1 Cby1.1 Cby2.1 Cby3.1 Cby4.1 Cby5.1 Cby6.1 Cby7.1 Cdc48V.1(+) MOV2.1 Rdiv3.2 S2.2(D) TVS2.1(K) ; port Vout+
NetBobbin_1: Bobbin.1 Bobbin.2 Bobbin.3 Bobbin.4 Bobbin.5 ; port IL_out
NetCboot_1: Cboot.1 Dboot.1(K) IC1_Socket.8(VB)
NetCfilter2_2: Cfilter2.2 OP-AMP2.3(NONINVERTING_INPUT_A) Rdiv3.1 Rdiv4.2
NetD1_1: D1.1(K) Roff:1.2
NetD1_2: D1.2(A) Rgs1.1 Ron:1.2 S2.1(G)
NetD2_1: D2.1(K) Roff:2.2
NetD2_2: D2.2(A) Rgs2.1 Ron:2.2 S1.1(G)
NetDboot_2: Dboot.2(A) Rboot.1
NetIC1_Socket_2: IC1_Socket.2(SD) ; port SD
NetOP-AMP2_1: OP-AMP2.1(OUTPUT_A) OP-AMP2.2(INVERTING_INPUT_A) ; port Vo_Sense

Not connected (* = marked no-connect by the designer): IC1 1(IN)* 2(~{SD})* 3(COM)* 4(LO)* 5(VCC)* 6(VS)* 7(HO)* 8(VB)*; OP-AMP2 5(NONINVERTING_INPUT_B)* 6(INVERTING_INPUT_B)* 7(OUTPUT_B)*

### Notes on the sheet
- Boost Stage
- 24V input 48V output
- 50kHz Switching
- Resistors 1/4W unless specified
- C= ic*D*Ts/(2*dV)
  For 200W, ic = 4A.
  ic = 4A, D=0.5, Ts = 1/50k,
  dV= 0.48V
  C = 41.67uF
  DClink = C*2 = 86.8125uF
- (near 48V_test) Voltage Divider:
  Choose R2 = 10k ohm
  Vo = Vin*R2*R1/(R2+R1)
  3.3V = 48V*R2*R1/(R2+R1)
  R1 = 135.7k ohm
  **DIVIDE R's by 10, MULTIPLY C by 10
- Roff > Ron
  Iho = 1.4A = (VDD-Vboot)/(Rg+x)
  = (12-1)/(1.3+x)
  x = 6.55 ohm
  Ihi = 1.8A = (VDD-Vboot-VSD)/(Rg+x)
  = (12-1-0.6)/1.3+x
  x = 4.5ohm
  as X increase, source current decrease.
- Choose Electrolytic Cap = 100uF
- (near 48V_test) Total Capacitance 125uF
- (near Rgs2) High Rgs for smaller current
- (near Cfilter2) 3.3V divider
- (near Bobbin) L = V*D*Ts/(2*di)
  L = 24*0.5*20us/(2*0.3)
  L = 0.4mH
- Cboot = Qtotal/dVboot
  dVboot = 5%*12V = 0.6V
  26nC/0.6V = 0.043uF
  Cboot = 0.1uF
- Iboot = (Vin-VFD)/Rboot
  Vin = 12V
  VFD = 1V
  Choose Rboot = 10ohm
  based on current rating of Dboot
  Iboot = 1.1A
- (near OP-AMP2) Filter Calculation:
  Using fc = (R1+R2)/(2*pi*R1*R2*C)
  fc = half of switching freq.
  fc = 25kHz
  R1 = 135k ohm, R2 = 10k ohm
  C = 0.68377 nF
  Choose C = 10nF
- (near HeatSink) 50 kHz Switching Frequency

### Library data of the parts
48V_test = 1729128: as 24V on sheet PowerSupply; Datasheet Link: http://docs-emea.rs-online.com/webdocs/1380/0900766b81380189.pdf; Height: 10mm; Manufacturer_Part_Number: 1729128; Mouser Part Number: 651-1729128; Mouser Price/Stock: https://www.mouser.co.uk/ProductDetail/Phoenix-Contact/1729128?qs=GFUSqQMLmmnCBVBY3dts9w%3D%3D; Arrow Part Number: 1729128; Arrow Price/Stock: https://www.arrow.com/en/products/1729128/phoenix-contact
Bobbin = B66422W1010D1: Bobbin; Manufacturer_Name: EPCOS; Datasheet Link: https://componentsearchengine.com/Datasheets/1/B66422W1010D1.pdf; Height: 12mm; Mouser2 Part Number: 871-B66422W1010D1; Mouser2 Price/Stock: https://www.mouser.com/Search/Refine.aspx?Keyword=871-B66422W1010D1; Manufacturer_Part_Number: B66422W1010D1
Cboot Cby1 Cby2 Cby4-Cby6 = CMP-08246-003576-1: Multilayer Ceramic Capacitors 1uF ±20% 50V JB SMD 1206; Capacitance: 1uF; Tolerance: 20%; Case/Package: 1206; Height: 1.6mm; Series: C; Termination: SMD/SMT; Case Code (Imperial): 1206; Voltage Rating: 50V; Max Operating Temperature: 85°C; Lead Free: Lead Free; Length: 0.126inch; Min Operating Temperature: -25°C; Case Code (Metric): 3216; Thickness: 0.069inch; Package Quantity: 2000; Width: 1.6mm; Voltage Rating (DC): 50V; Resistor Type: Ceramic; Mount: Surface Mount; Dielectric Material: Ceramic; Packaging: Tape and Reel
Cby3 Cby7 = GRM31CR61H106KA12K: Capacitor Ceramic 10uF; Manufacturer_Name: Murata Electronics; Datasheet Link: http://www.murata.com/~/media/webrenewal/support/library/catalog/products/capacitor/mlcc/c02e.pdf; Height: 1.8mm; Manufacturer_Part_Number: GRM31CR61H106KA12K; Mouser Part Number: 81-GRM31CR61H106KA2K; Mouser Price/Stock: https://www.mouser.co.uk/ProductDetail/Murata-Electronics/GRM31CR61H106KA12K?qs=hNud%2FORuBR2LdVXo%252BGUPLw%3D%3D
Cby8 = CMP-2007-04362-1: Manufacturer: AVX Interconnect / Elco; Part Number: 08055C103K4Z2A
Cdc48V = EEU-FR2A101: 100uF Capacitor Polarised; Manufacturer_Name: Panasonic; Datasheet Link: https://industrial.panasonic.com/cdbs/www-data/pdf/RDF0000/ABA0000C1259.pdf; Height: 22mm; Manufacturer_Part_Number: EEU-FR2A101; Mouser Part Number: 667-EEU-FR2A101; Mouser Price/Stock: https://www.mouser.co.uk/ProductDetail/Panasonic/EEU-FR2A101?qs=n7vHx8wJlDHCZg6DRLuY%252Bw%3D%3D
Cfilter2 = CMP-1037-03540-1: as Cfilter1 on sheet PowerSupply; Rated Voltage: 500 V; Value: 10nF; Max Thickness: 1.7 mm; Technology: SMT
D1 D2 = 1N4148B: Diode; Manufacturer_Name: Vishay; Datasheet Link: https://www.vishay.com/docs/81857/1n4148.pdf; Manufacturer_Part_Number: 1N4148B
Dboot = SB3H100-E3_54: Schottky Diode; Manufacturer_Name: Vishay; Manufacturer_Part_Number: SB3H100-E3/54; Datasheet Link: http://www.vishay.com/docs/88720/sb3h90.pdf; Mouser Part Number: 625-SB3H100-E3; Mouser Price/Stock: https://www.mouser.com/Search/Refine.aspx?Keyword=625-SB3H100-E3
HeatSink = WV-DT2-101E: Hardware; Manufacturer_Name: Ohmite; Datasheet Link: https://componentsearchengine.com/Datasheets/1/WV-DT2-101E.pdf; Height: 32.3mm; Manufacturer_Part_Number: WV-DT2-101E; Mouser Part Number: 588-WV-DT2-101E; Mouser Price/Stock: https://www.mouser.com/Search/Refine.aspx?Keyword=588-WV-DT2-101E
IC1 = IRS2184PBF: Integrated Circuit; Manufacturer_Name: Infineon; Datasheet Link: http://uk.rs-online.com/web/p/products/0456214; Height: 5.33mm; Manufacturer_Part_Number: IRS2184PBF; Mouser Part Number: 942-IRS2184PBF; Mouser Price/Stock: https://www.mouser.co.uk/ProductDetail/Infineon-Technologies/IRS2184PBF?qs=9%252BKlkBgLFf3%2F4k8XP8%252BWIw%3D%3D; Arrow Part Number: IRS2184PBF; Arrow Price/Stock: https://www.arrow.com/en/products/irs2184pbf/infineon-technologies-ag
IC1_Socket = DILB8P-223TLF: Connector; Manufacturer_Name: Amphenol; Datasheet Link: https://componentsearchengine.com/Datasheets/1/DILB8P-223TLF.pdf; Height: 5.25mm; Mouser2 Part Number: 649-DILB8P223TLF; Mouser2 Price/Stock: https://www.mouser.com/Search/Refine.aspx?Keyword=649-DILB8P223TLF; Manufacturer_Part_Number: DILB8P-223TLF
MOV2 = V68ZS10P: Varistor; Manufacturer_Name: LITTELFUSE; Datasheet Link: http://www.littelfuse.com/~/media/electronics/datasheets/varistors/littelfuse_varistor_za_datasheet.pdf.pdf; Height: 20mm; Manufacturer_Part_Number: V68ZS10P; Mouser Part Number: 576-V68ZS10P; Mouser Price/Stock: https://www.mouser.co.uk/ProductDetail/Littelfuse/V68ZS10P?qs=1%2FWRN91BpNvIRlTsONWDiQ%3D%3D
OP-AMP2 = LMC6482IN_NOPB: as OP-AMP1 on sheet PowerSupply; Datasheet Link: http://www.ti.com/lit/gpn/lmc6482; Height: 5.08mm; Mouser Part Number: 926-LMC6482IN/NOPB; Mouser Price/Stock: https://www.mouser.co.uk/ProductDetail/Texas-Instruments/LMC6482IN-NOPB?qs=QbsRYf82W3EByDDrj8Vijg%3D%3D; Arrow Part Number: LMC6482IN/NOPB; Arrow Price/Stock: https://www.arrow.com/en/products/lmc6482innopb/texas-instruments
Rboot = Res1: 1/2W 10ohm Resistor; Published: 8-Jun-2000; LatestRevisionDate: 17-Jul-2002; LatestRevisionNote: Re-released for DXP Platform.; PackageReference: AXIAL-0.3; Publisher: Altium Limited; PackageDescription: Axial Device, Thru-Hole; 2 Leads; 0.3 in Pin Spacing
Rdiv3 = Res1: 1/4W 135.455k ohm Resistor; Published: 8-Jun-2000; LatestRevisionDate: 17-Jul-2002; LatestRevisionNote: Re-released for DXP Platform.; PackageReference: AXIAL-0.3; Publisher: Altium Limited; PackageDescription: Axial Device, Thru-Hole; 2 Leads; 0.3 in Pin Spacing
Rdiv4 Rgs1 Rgs2 = Res1: 1/4W 10k ohm Resistor; Published: 8-Jun-2000; LatestRevisionDate: 17-Jul-2002; LatestRevisionNote: Re-released for DXP Platform.; PackageReference: AXIAL-0.3; Publisher: Altium Limited; PackageDescription: Axial Device, Thru-Hole; 2 Leads; 0.3 in Pin Spacing
Roff:1 Roff:2 = Res1: 1/4W 10ohm Resistor; Published: 8-Jun-2000; LatestRevisionDate: 17-Jul-2002; LatestRevisionNote: Re-released for DXP Platform.; PackageReference: AXIAL-0.3; Publisher: Altium Limited; PackageDescription: Axial Device, Thru-Hole; 2 Leads; 0.3 in Pin Spacing
Ron:1 Ron:2 = Res1: 1/4W 8ohm Resistor; Published: 8-Jun-2000; LatestRevisionDate: 17-Jul-2002; LatestRevisionNote: Re-released for DXP Platform.; PackageReference: AXIAL-0.3; Publisher: Altium Limited; PackageDescription: Axial Device, Thru-Hole; 2 Leads; 0.3 in Pin Spacing
S1 S2 = IRFB4615PBF: MOSFET (N-Channel); Manufacturer_Name: Infineon; Datasheet Link: https://static6.arrow.com/aropdfconversion/fc085eb00e813bec65c58b34c53aeea1d8b02a1f/irfb4615pbf.pdf; Height: 4.83mm; Manufacturer_Part_Number: IRFB4615PBF; Mouser Part Number: 942-IRFB4615PBF; Mouser Price/Stock: https://www.mouser.co.uk/ProductDetail/Infineon-Technologies/IRFB4615PBF?qs=9%252BKlkBgLFf20BbweusQYXA%3D%3D; Arrow Part Number: IRFB4615PBF; Arrow Price/Stock: https://www.arrow.com/en/products/irfb4615pbf/infineon-technologies-ag
TVS2 = P6KE91A-E3_54: as TVS1 on sheet PowerSupply; Datasheet Link: https://www.mouser.com/datasheet/2/427/p6ke-1767850.pdf

## Sheet DrivePowerModule.SchDoc
size A
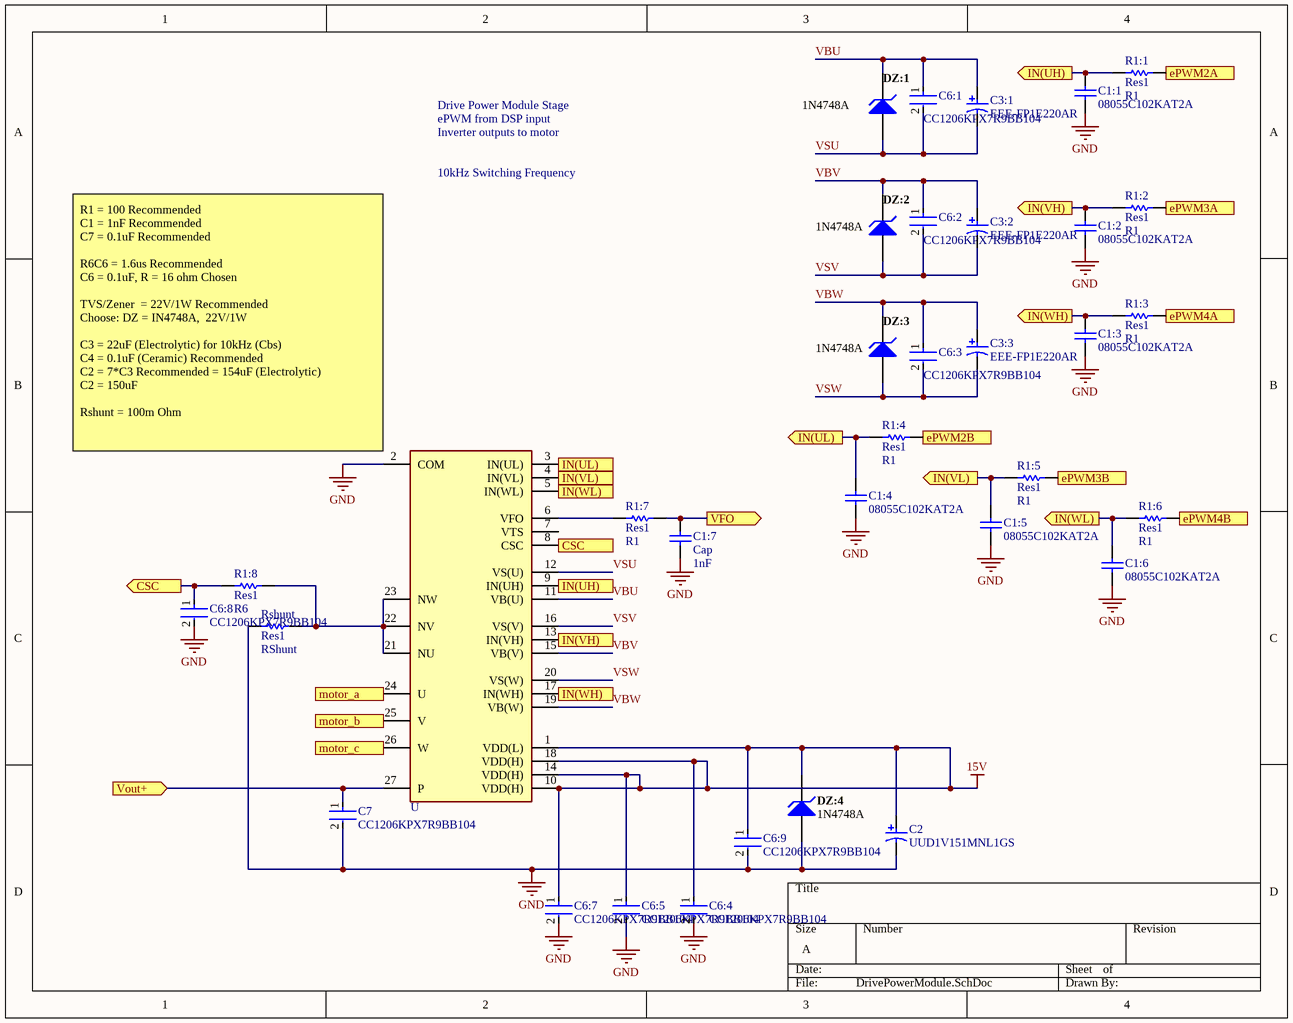
[diagram p5: DrivePowerModule.SchDoc]

### Parts
C1:1  08055C102KAT2A  [CAPC2013X94X50ML20T25]
C1:2  08055C102KAT2A  [CAPC2013X94X50ML20T25]
C1:3  08055C102KAT2A  [CAPC2013X94X50ML20T25]
C1:4  08055C102KAT2A  [CAPC2013X94X50ML20T25]
C1:5  08055C102KAT2A  [CAPC2013X94X50ML20T25]
C1:6  08055C102KAT2A  [CAPC2013X94X50ML20T25]
C1:7  Cap  value 1nF  [RAD-0.3]
C2  UUD1V151MNL1GS  [NIC-CAPA2-8X10_V]
C3:1  EEE-FP1E220AR  [PNSC-FP-V-C_V]
C3:2  EEE-FP1E220AR  [PNSC-FP-V-C_V]
C3:3  EEE-FP1E220AR  [PNSC-FP-V-C_V]
C6:1  CC1206KPX7R9BB104  [FP-CC1206-1_25-MFG]
C6:2  CC1206KPX7R9BB104  [FP-CC1206-1_25-MFG]
C6:3  CC1206KPX7R9BB104  [FP-CC1206-1_25-MFG]
C6:4  CC1206KPX7R9BB104  [FP-CC1206-1_25-MFG]
C6:5  CC1206KPX7R9BB104  [FP-CC1206-1_25-MFG]
C6:7  CC1206KPX7R9BB104  [FP-CC1206-1_25-MFG]
C6:8  CC1206KPX7R9BB104  [FP-CC1206-1_25-MFG]
C6:9  CC1206KPX7R9BB104  [FP-CC1206-1_25-MFG]
C7  CC1206KPX7R9BB104  [FP-CC1206-1_25-MFG]
DZ:1  1N4748A  [FAIR-DO-41-2_V]
DZ:2  1N4748A  [FAIR-DO-41-2_V]
DZ:3  1N4748A  [FAIR-DO-41-2_V]
DZ:4  1N4748A  [FAIR-DO-41-2_V]
R1:1  Res1  value R1  [AXIAL-0.3]
R1:2  Res1  value R1  [AXIAL-0.3]
R1:3  Res1  value R1  [AXIAL-0.3]
R1:4  Res1  value R1  [AXIAL-0.3]
R1:5  Res1  value R1  [AXIAL-0.3]
R1:6  Res1  value R1  [AXIAL-0.3]
R1:7  Res1  value R1  [AXIAL-0.3]
R1:8  Res1  value R6  [AXIAL-0.3]
Rshunt  Res1  value RShunt  [AXIAL-0.3]
U  FNB34060T  [FNB34060T]  (value not drawn)

### Ports
CSC (in), CSC (out), ePWM2A (in), ePWM2B (in), ePWM3A (in), ePWM3B (in), ePWM4A (in), ePWM4B (in), IN(UH) (in), IN(UH) (out), IN(UL) (in), IN(UL) (out), IN(VH) (in), IN(VH) (out), IN(VL) (in), IN(VL) (out), IN(WH) (in), IN(WH) (out), IN(WL) (in), IN(WL) (out), motor_a (out), motor_b (out), motor_c (out), VFO (out), Vout+ (in)

### Nets
15V: C2.1 C6:4.1 C6:5.1 C6:7.1 C6:9.1 DZ:4.2(K) U.1(VDD(L)) U.10(VDD(H)) U.14(VDD(H)) U.18(VDD(H))
GND: C1:1.2 C1:2.2 C1:3.2 C1:4.2 C1:5.2 C1:6.2 C1:7.1 C2.2 C6:4.2 C6:5.2 C6:7.2 C6:8.2 C6:9.2 C7.2 DZ:4.1(A) Rshunt.1 U.2(COM)  [project net  GND]
VBU: C3:1.1 C6:1.1 DZ:1.2(K) U.11(VB(U))
VBV: C3:2.1 C6:2.1 DZ:2.2(K) U.15(VB(V))
VBW: C3:3.1 C6:3.1 DZ:3.2(K) U.19(VB(W))
VSU: C3:1.2 C6:1.2 DZ:1.1(A) U.12(VS(U))
VSV: C3:2.2 C6:2.2 DZ:2.1(A) U.16(VS(V))
VSW: C3:3.2 C6:3.2 DZ:3.1(A) U.20(VS(W))
Net3Terminal:2_3: U.26(W) ; port motor_c
Net48V_test_1: C7.1 U.27(P) ; port Vout+
NetC1:1_1: C1:1.1 R1:1.1 U.9(IN(UH)) ; port IN(UH)
NetC1:2_1: C1:2.1 R1:2.1 U.13(IN(VH)) ; port IN(VH)
NetC1:3_1: C1:3.1 R1:3.1 U.17(IN(WH)) ; port IN(WH)
NetC1:4_1: C1:4.1 R1:4.1 U.3(IN(UL)) ; port IN(UL)
NetC1:5_1: C1:5.1 R1:5.1 U.4(IN(VL)) ; port IN(VL)
NetC1:6_1: C1:6.1 R1:6.1 U.5(IN(WL)) ; port IN(WL)
NetC1:7_2: C1:7.2 R1:7.2 ; port VFO
NetC6:8_1: C6:8.1 R1:8.1 U.8(CSC) ; port CSC
Nethall_IA_1: U.24(U) ; port motor_a
Nethall_IB_1: U.25(V) ; port motor_b
NetR1:1_2: R1:1.2 ; port ePWM2A
NetR1:2_2: R1:2.2 ; port ePWM3A
NetR1:3_2: R1:3.2 ; port ePWM4A
NetR1:4_2: R1:4.2 ; port ePWM2B
NetR1:5_2: R1:5.2 ; port ePWM3B
NetR1:6_2: R1:6.2 ; port ePWM4B
NetR1:7_1: R1:7.1 U.6(VFO)
NetR1:8_2: R1:8.2 Rshunt.2 U.21(NU) U.22(NV) U.23(NW)

Not connected (* = marked no-connect by the designer): U 7(VTS)

### Notes on the sheet
- Drive Power Module Stage
- ePWM from DSP input
- Inverter outputs to motor
- 10kHz Switching Frequency
- (near U) R1 = 100 Recommended
  C1 = 1nF Recommended
  C7 = 0.1uF Recommended
  R6C6 = 1.6us Recommended
  C6 = 0.1uF, R = 16 ohm Chosen
  TVS/Zener  = 22V/1W Recommended
  Choose: DZ = IN4748A,  22V/1W
  C3 = 22uF (Electrolytic) for 10kHz (Cbs)
  C4 = 0.1uF (Ceramic) Recommended
  C2 = 7*C3 Recommended = 154uF (Electrolytic)
  C2 = 150uF
  Rshunt = 100m Ohm

### Library data of the parts
C1:1-C1:6 = CMP-1036-02979-2: 1nF Ceramic Cap 50V; Part Number: 08055C102KAT2A.; Manufacturer: AVX Interconnect / Elco
C1:7 = Cap: Capacitor; Published: 8-Jun-2000; LatestRevisionDate: 17-Jul-2002; LatestRevisionNote: Re-released for DXP Platform.; PackageReference: RAD-0.3; Publisher: Altium Limited; PackageDescription: Radial Cap, Thru-Hole; 2 Leads; 0.3 in Pin Spacing
C2 = CMP-0687-00078-1: Aluminum Electrolytic Capacitor, UD Series, Low Impedance, 150 uF, 35 V, + / - 20%, -55 to 105 degC, Chip Type, 8 x 10 mm D x L, Pb-Free, Reel; Manufacturer: Nichicon; Endurance Time: 5000 h; Tolerance Rated Capacitance: -20 to 20%; Rated Capacitance: 150 uF; Packing: Dia382mm Reel; Rated Ripple Current (at 100kHz): 450 mA; Impedance: 0.17 Ohm; Rated Voltage: 35 V; RoHS: TRUE; ComponentLink3Description: Package Specification; DatasheetVersion: 08/2012; PackageDescription: 2-Pin Surface Mount Device, Diameter 8 mm, Height 10 mm, Pitch 6.5 mm; Diameter: 8 mm; PartNumber: UUD1V151MNL1GS; Mounting Technology: Surface Mount; PackageReference: CAPAE-D8H10; ComponentLink3URL: http://products.nichicon.co.jp/en/pdf/XJA043/e-ud.pdf; ComponentLink2Description: Datasheet; ComponentLink1Description: Manufacturer URL; ComponentLink1URL: http://www.nichicon.co.jp/; ComponentLink2URL: http://products.nichicon.co.jp/en/pdf/XJA043/e-ud.pdf; Length: 10 mm
C3:1-C3:3 = CMP-2000-06213-1: Aluminum Electrolytic Capacitor, 22 uF, +/- 20%, 25 V, 2-Pin SMD (Size Code C), -55 to 105 degC, RoHS, Tape and Reel; Manufacturer: Panasonic; ESR (Equivalent Series Resistance): 0.36O; Ripple Current: 240mA; Capacitance: 22µF; Lifetime@Temperature: 2000Hrs@105°C; Rated Voltage: 25V; Type: Can; Package Reference: FP-V-C; Package Description: 2-Pin Electrolytic Aluminum Capacitor, Body 5.3 x 5.3 mm; Operating Temp Range: -55to+105°C; Mounting Technology: SurfaceMount; Datasheet URL: http://industrial.panasonic.com/cdbs/www-data/pdf/RDE0000/ABA0000C1184.pdf; Case Size/Dimension: Ø5x5.8mm; Operating Temp-Max: 105°C; Package URL: http://industrial.panasonic.com/cdbs/www-data/pdf/RDE0000/DME0000COL48.pdf; Datasheet Version: 03/2016; Series: FP; Manufacturer URL: http://www.panasonic.com/
C6:1-C6:5 C6:7-C6:9 C7 = CMP-03422-000130-1: CC1206 100 nF X7R 10.00%50 V; Manufacturer: Yageo; Capacitance: 100 nF; Tolerance: 0.1; Value: 100 nF; Temperature Coefficient: 15%; Material: Ceramic; Voltage Rating: 50 V; Automotive Grade: NA; Octopart: https://octopart.com/cc1206kpx7r9bb104-yageo-16251820; Footprint Url: http://www.yageo.com/exep/pages/download/literatures/UPY-C_GEN_24.pdf; ComponentLink2Description: Datasheet; Temperature Range Low: -55°C; Temperature: -55°C to +125°C; RoHS: TRUE; Mouser Description: Surface Mount Ceramic Multilayer Capacitor 0.1uF 10% X7R 50V 1206 Paper T/R; Device Class L1: Passive Components; Height: 1.45mm; Device Class L3: Ceramic Capacitors; Manufacturer Part Number: CC1206KPX7R9BB104; Temperature Characteristic: X7R; Device Class L2: Capacitors; Package: CC1206-1.25; Category: Cap; Lead Free: Yes; Automotive: No; ComponentLink2URL: http://www.yageo.com/documents/recent/UPY-NP0X7R_HV_1KV-to-3KV_11.pdf; Temperature Range High: +125°C
DZ:1-DZ:4 = CMP-0892-00021-1: Zener Diode, 22V, 1W, 5%, -65 to 200 degC, 2-Pin DO-41, Body 2.72 x 5.2 mm, RoHS; Manufacturer: Fairchild Semiconductor; VZ (Max.) (V): 23.1; IR (uA): 5; PD (W): 1; Test Current IZ (mA): 11.5; ZZ (Max) (ohm): 22; VZ (Min.) (V): 20.9; ComponentLink2Description: Datasheet; PartNumber: 1N4748A; Operating and Storage Temperature Range: -65 to 200 degC; PackageDescription: 2-Pin Axial leaded, Body 2.72 x 5.2 mm, Lead Spread 25.4 mm; ComponentLink3Description: Package Specification; RoHS: TRUE; PackageVersion: Rev. 2; ComponentLink1URL: http://www.fairchildsemi.com/; DatasheetVersion: Rev. H3; Mounting Technology: Through Hole; ComponentLink1Description: Manufacturer URL; ComponentLink3URL: http://www.fairchildsemi.com/dwg/DO/DO41A.pdf; PackageReference: DO-41-2; ComponentLink2URL: http://www.fairchildsemi.com/ds/1N/1N4744A.pdf; Tolerance: 5%
R1:1-R1:7 Rshunt = Res1: Resistor; Published: 8-Jun-2000; LatestRevisionDate: 17-Jul-2002; LatestRevisionNote: Re-released for DXP Platform.; PackageReference: AXIAL-0.3; Publisher: Altium Limited; PackageDescription: Axial Device, Thru-Hole; 2 Leads; 0.3 in Pin Spacing
R1:8 = Res1: 1/4W 16ohm Resistor; Published: 8-Jun-2000; LatestRevisionDate: 17-Jul-2002; LatestRevisionNote: Re-released for DXP Platform.; PackageReference: AXIAL-0.3; Publisher: Altium Limited; PackageDescription: Axial Device, Thru-Hole; 2 Leads; 0.3 in Pin Spacing

## Sheet Sensors.SchDoc
size A
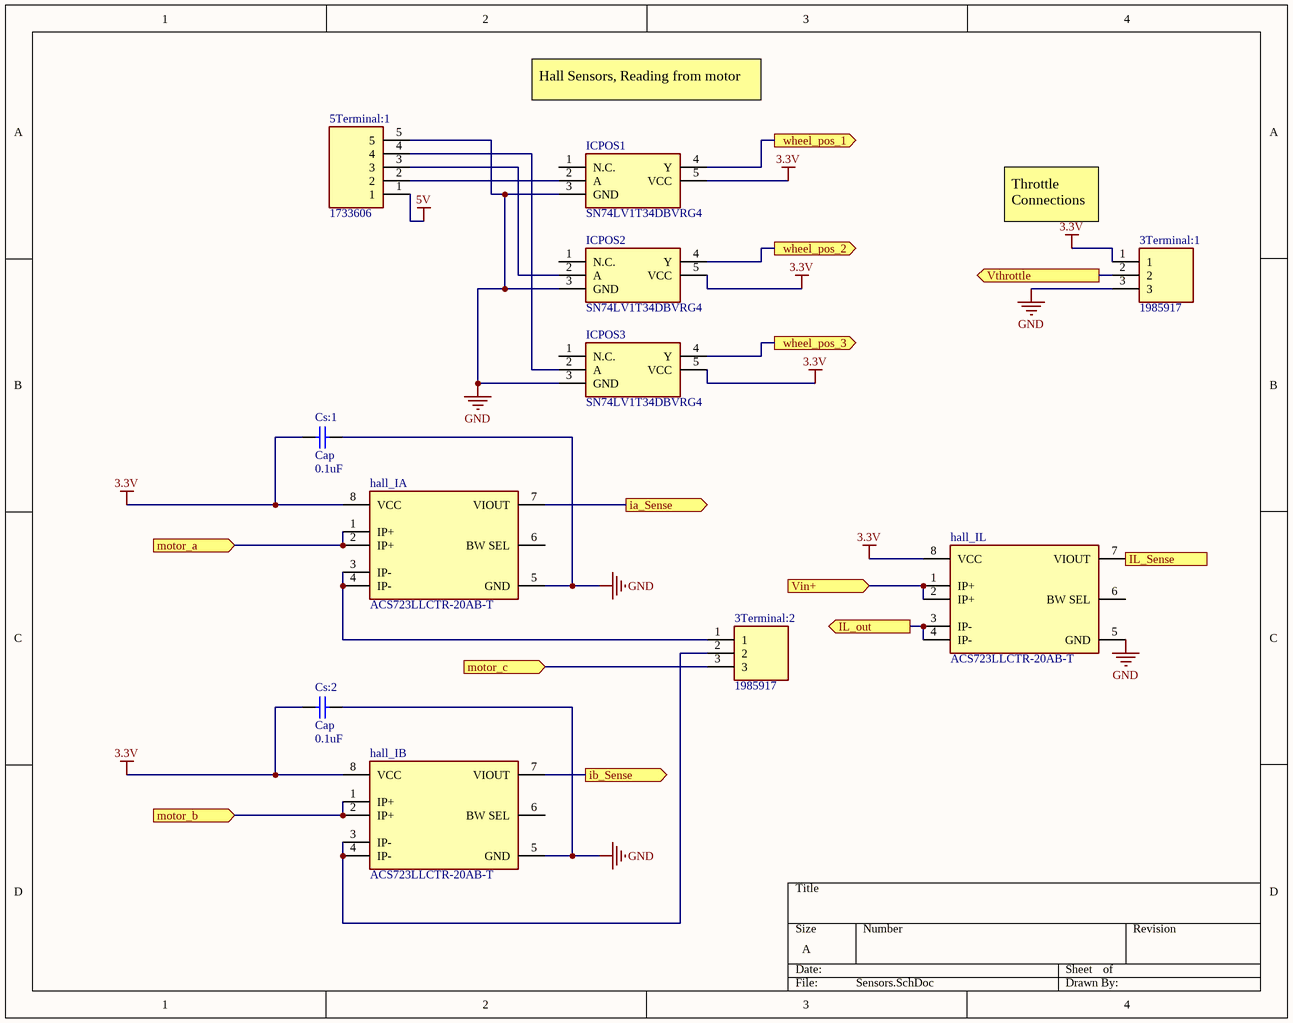
[diagram p6: Sensors.SchDoc]

### Parts
3Terminal:1  1985917  [1985917]
3Terminal:2  1985917  [1985917]
5Terminal:1  1733606  [1733606]
Cs:1  Cap  value 0.1uF  [RAD-0.3]
Cs:2  Cap  value 0.1uF  [RAD-0.3]
hall_IA  ACS723LLCTR-20AB-T  [FP-LC-8-IPC_C]
hall_IB  ACS723LLCTR-20AB-T  [FP-LC-8-IPC_C]
hall_IL  ACS723LLCTR-20AB-T  [FP-LC-8-IPC_C]
ICPOS1  SN74LV1T34DBVRG4  [SOT95P280X145-5N]
ICPOS2  SN74LV1T34DBVRG4  [SOT95P280X145-5N]
ICPOS3  SN74LV1T34DBVRG4  [SOT95P280X145-5N]

### Ports
ia_Sense (out), ib_Sense (out), IL_out (out), IL_Sense (out), motor_a (in), motor_b (in), motor_c (in), Vin+ (in), Vthrottle (out), wheel_pos_1 (out), wheel_pos_2 (out), wheel_pos_3 (out)

### Nets
3.3V: 3Terminal:1.1 Cs:1.1 Cs:2.1 hall_IA.8(VCC) hall_IB.8(VCC) hall_IL.8(VCC) ICPOS1.5(VCC) ICPOS2.5(VCC) ICPOS3.5(VCC)
5V: 5Terminal:1.1
GND: 3Terminal:1.3 5Terminal:1.5 Cs:1.2 Cs:2.2 hall_IA.5(GND) hall_IB.5(GND) hall_IL.5(GND) ICPOS1.3(GND) ICPOS2.3(GND) ICPOS3.3(GND)  [project net  GND]
Net3Terminal:1_2: 3Terminal:1.2 ; port Vthrottle
Net3Terminal:2_1: 3Terminal:2.1 hall_IA.3(IP-) hall_IA.4(IP-)
Net3Terminal:2_2: 3Terminal:2.2 hall_IB.3(IP-) hall_IB.4(IP-)
Net3Terminal:2_3: 3Terminal:2.3 ; port motor_c
Net5Terminal:1_2: 5Terminal:1.2 ICPOS1.2(A)
Net5Terminal:1_3: 5Terminal:1.3 ICPOS2.2(A)
Net5Terminal:1_4: 5Terminal:1.4 ICPOS3.2(A)
NetBobbin_1: hall_IL.3(IP-) hall_IL.4(IP-) ; port IL_out
NetCdc24V_1: hall_IL.1(IP+) hall_IL.2(IP+) ; port Vin+
Nethall_IA_1: hall_IA.1(IP+) hall_IA.2(IP+) ; port motor_a
Nethall_IA_7: hall_IA.7(VIOUT) ; port ia_Sense
Nethall_IB_1: hall_IB.1(IP+) hall_IB.2(IP+) ; port motor_b
Nethall_IB_7: hall_IB.7(VIOUT) ; port ib_Sense
Nethall_IL_7: hall_IL.7(VIOUT) ; port IL_Sense
NetICPOS1_4: ICPOS1.4(Y) ; port wheel_pos_1
NetICPOS2_4: ICPOS2.4(Y) ; port wheel_pos_2
NetICPOS3_4: ICPOS3.4(Y) ; port wheel_pos_3

Not connected (* = marked no-connect by the designer): hall_IA 6(BW_SEL); hall_IB 6(BW_SEL); hall_IL 6(BW_SEL); ICPOS1 1(N.C.); ICPOS2 1(N.C.); ICPOS3 1(N.C.)

### Notes on the sheet
- Hall Sensors, Reading from motor
- Throttle Connections

### Library data of the parts
3Terminal:1 3Terminal:2 = 1985917: Connector; Manufacturer_Name: Phoenix Contact; Datasheet Link: https://media.digikey.com/pdf/Data%20Sheets/Phoenix%20Contact%20PDFs/Multi-Postion%20PCTerminal%20Blocks.pdf; Height: 13.95mm; Manufacturer_Part_Number: 1985917; Mouser Part Number: 651-1985917; Mouser Price/Stock: https://www.mouser.co.uk/ProductDetail/Phoenix-Contact/1985917/?qs=ibOxrZ%2Fd8eDdpJplVMXgvQ%3D%3D; Arrow Part Number: 1985917; Arrow Price/Stock: https://www.arrow.com/en/products/1985917/phoenix-contact
5Terminal:1 = 1733606: as J? on sheet ee453_pcb_yourname; Datasheet Link: https://www.phoenixcontact.com/online/portal/us?uri=pxc-oc-itemdetail:pid=1733606&library=usen&tab=1; Height: 15.45mm; Manufacturer_Part_Number: 1733606; Mouser Part Number: 651-1733606; Mouser Price/Stock: https://www.mouser.co.uk/ProductDetail/Phoenix-Contact/1733606/?qs=coeDwHeOZKnxpzvXWWKBZQ%3D%3D; Arrow Part Number: 1733606; Arrow Price/Stock: https://www.arrow.com/en/products/1733606/phoenix-contact
Cs:1 Cs:2 = Cap: Capacitor; Published: 8-Jun-2000; LatestRevisionDate: 17-Jul-2002; LatestRevisionNote: Re-released for DXP Platform.; PackageReference: RAD-0.3; Publisher: Altium Limited; PackageDescription: Radial Cap, Thru-Hole; 2 Leads; 0.3 in Pin Spacing
hall_IA hall_IB hall_IL = CMP-82923-000025-1: SENSOR CURRENT HALL 20A AC/DC; Number of Channels: 1; Max Input Voltage: 5.5V; Polarity: Bidirectional; Sensitivity: 100mV/A; Max Supply Current: 14mA; Frequency: 80kHz; Linearity: 1%; Response Time: 5us; Min Input Voltage: 4.5V; Accuracy: 3%; Mount: Surface Mount; Length: 4.9mm; Packaging: Tape and Reel; Height: 1.5mm; Current Sensing: 20A; RoHS Compliant: Yes; Number of Pins: 8; Max Operating Temperature: 150°C; Width: 3.9mm; Case/Package: SOIC; Min Operating Temperature: -40°C
ICPOS1-ICPOS3 = SN74LV1T34DBVRG4: as IC?#1 on sheet ee453_pcb_yourname; Datasheet Link: http://www.ti.com/lit/gpn/sn74lv1t34; Height: 1.45mm; Manufacturer_Part_Number: SN74LV1T34DBVRG4; Mouser Part Number: 595-SN74LV1T34DBVRG4; Mouser Price/Stock: https://www.mouser.co.uk/ProductDetail/Texas-Instruments/SN74LV1T34DBVRG4?qs=vdi0iO8H4N10R%252Bt%252BjmxZrg%3D%3D; Arrow Part Number: SN74LV1T34DBVRG4; Arrow Price/Stock: https://www.arrow.com/en/products/sn74lv1t34dbvrg4/texas-instruments